# Altium project HV DAC 8ch.PrjPCB (part 1 of 6)
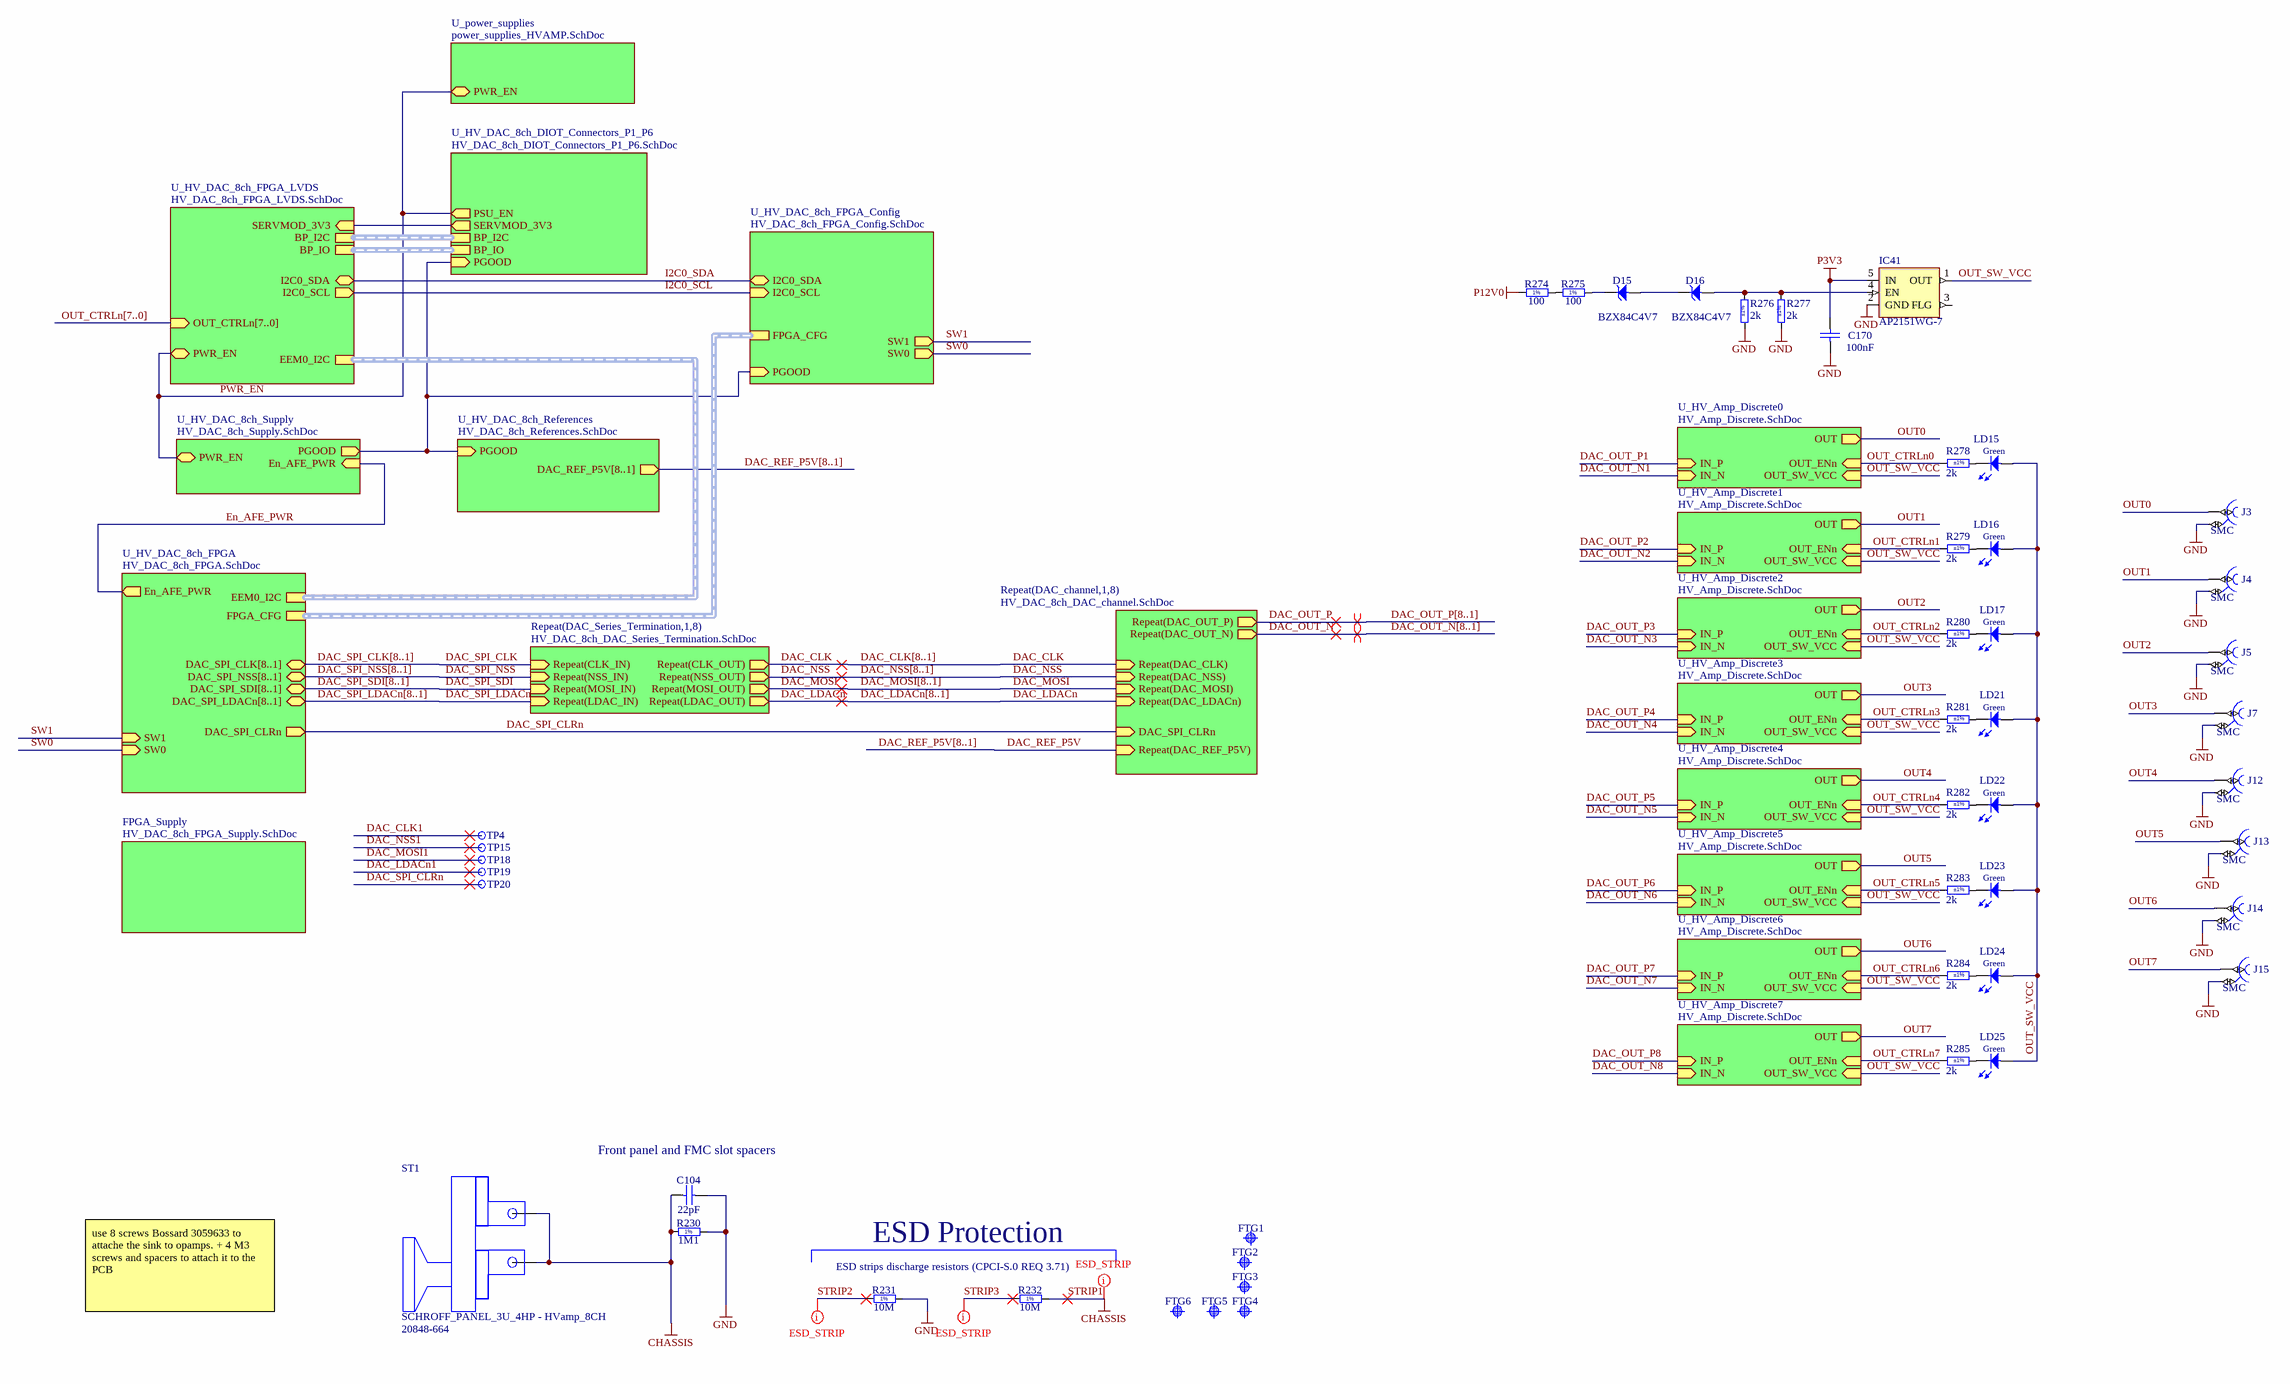
[diagram p0: HV_DAC_8ch-DIOT.schdoc]
revision: 1.0
10 sheets, 908 parts. Net scope: hierarchical (ports join the sheet entries above them; power ports are global).
Board file: HV_DAC_8ch-DIOT.PCBDOC
Sheets:
  HV_DAC_8ch-DIOT.schdoc
    DAC_channel1 = HV_DAC_8ch_DAC_channel.SchDoc
    DAC_channel2 = HV_DAC_8ch_DAC_channel.SchDoc
    DAC_channel3 = HV_DAC_8ch_DAC_channel.SchDoc
    DAC_channel4 = HV_DAC_8ch_DAC_channel.SchDoc
    DAC_channel5 = HV_DAC_8ch_DAC_channel.SchDoc
    DAC_channel6 = HV_DAC_8ch_DAC_channel.SchDoc
    DAC_channel7 = HV_DAC_8ch_DAC_channel.SchDoc
    DAC_channel8 = HV_DAC_8ch_DAC_channel.SchDoc
    U_HV_DAC_8ch_FPGA = HV_DAC_8ch_FPGA.SchDoc
    U_HV_DAC_8ch_FPGA_Config = HV_DAC_8ch_FPGA_Config.SchDoc
    U_HV_DAC_8ch_FPGA_LVDS = HV_DAC_8ch_FPGA_LVDS.SchDoc
    U_HV_DAC_8ch_References = HV_DAC_8ch_References.SchDoc
    U_HV_DAC_8ch_Supply = HV_DAC_8ch_Supply.SchDoc
    U_HV_DAC_8ch_DIOT_Connectors_P1_P6 = HV_DAC_8ch_DIOT_Connectors_P1_P6.SchDoc
    U_power_supplies = power_supplies_HVAMP.SchDoc
    U_HV_Amp_Discrete0 = HV_Amp_Discrete.SchDoc
    U_HV_Amp_Discrete1 = HV_Amp_Discrete.SchDoc
    U_HV_Amp_Discrete2 = HV_Amp_Discrete.SchDoc
    U_HV_Amp_Discrete3 = HV_Amp_Discrete.SchDoc
    U_HV_Amp_Discrete4 = HV_Amp_Discrete.SchDoc
    U_HV_Amp_Discrete5 = HV_Amp_Discrete.SchDoc
    U_HV_Amp_Discrete6 = HV_Amp_Discrete.SchDoc
    U_HV_Amp_Discrete7 = HV_Amp_Discrete.SchDoc

## Sheet HV_DAC_8ch-DIOT.schdoc: Fastino v1.3 DIOT
size A2; EDA_Number: ARTIQ; Projet: Fastino; Author: G.Kasprowicz; CompanyName: WUT ISE; DrawnBy: G.Kasprowicz; Organization: WUT ISE; Address1: PW ISE; Address2: Nowowiejska 15/19 00-665 Warsaw; Address3: gkasprow@gmail.com; DocumentNumber: 1; Revision: 2; SheetNumber: 1; SheetTotal: 12; ModifiedBy: -; CheckedDate: -; Title2: Top; DivGrp: WUT ISE; Designer: G.Kasprowicz; ModifiedDate: -; ProjectName: Sensor Box

### Parts
C104  22pF  [CAPC1005X55N]
C170  100nF  [CAPC1005X55N]
D15  BZX84C4V7  [SOT95P240X130-3N]
D16  BZX84C4V7  [SOT95P240X130-3N]
FTG1  Use only in PCB  [FIDUCIAL_TOP_C100-200]  (value not drawn)
FTG2  Use only in PCB  [FIDUCIAL_TOP_S100-200]  (value not drawn)
FTG3  Use only in PCB  [FIDUCIAL_TOP_S100-200]  (value not drawn)
FTG4  Use only in PCB  [FIDUCIAL_TOP_S100-200]  (value not drawn)
FTG5  Use only in PCB  [FIDUCIAL_TOP_S100-200]  (value not drawn)
FTG6  Use only in PCB  [FIDUCIAL_TOP_S100-200]  (value not drawn)
IC41  AP2151WG-7  [SOT23-5]
J3  SMC  [JOHNSON_131-6701-341]
J4  SMC  [JOHNSON_131-6701-341]
J5  SMC  [JOHNSON_131-6701-341]
J7  SMC  [JOHNSON_131-6701-341]
J12  SMC  [JOHNSON_131-6701-341]
J13  SMC  [JOHNSON_131-6701-341]
J14  SMC  [JOHNSON_131-6701-341]
J15  SMC  [JOHNSON_131-6701-341]
LD15  Green  [LED_AVAGO_HSME-C120]
LD16  Green  [LED_AVAGO_HSME-C120]
LD17  Green  [LED_AVAGO_HSME-C120]
LD21  Green  [LED_AVAGO_HSME-C120]
LD22  Green  [LED_AVAGO_HSME-C120]
LD23  Green  [LED_AVAGO_HSME-C120]
LD24  Green  [LED_AVAGO_HSME-C120]
LD25  Green  [LED_AVAGO_HSME-C120]
R230  1M1  [RESC2012X60N]
R231  10M  [RESC2113X55N]
R232  10M  [RESC2113X55N]
R274  100  [RESC1005X40N]
R275  100  [RESC1005X40N]
R276  2k  Tolerance: ±1%  [RESC1005X40N]
R277  2k  Tolerance: ±1%  [RESC1005X40N]
R278  2k  Tolerance: ±1%  [RESC1005X40N]
R279  2k  Tolerance: ±1%  [RESC1005X40N]
R280  2k  Tolerance: ±1%  [RESC1005X40N]
R281  2k  Tolerance: ±1%  [RESC1005X40N]
R282  2k  Tolerance: ±1%  [RESC1005X40N]
R283  2k  Tolerance: ±1%  [RESC1005X40N]
R284  2k  Tolerance: ±1%  [RESC1005X40N]
R285  2k  Tolerance: ±1%  [RESC1005X40N]
ST1  SCHROFF_PANEL_3U_4HP - HVamp_8CH  Manufacturer Part Number 2: 20848-664  [SCHROFF_PANEL_3U_4HP - HVamp_8CH]
TP4  Test Point  [TPS127]  (value not drawn)
TP15  Test Point  [TPS127]  (value not drawn)
TP18  Test Point  [TPS127]  (value not drawn)
TP19  Test Point  [TPS127]  (value not drawn)
TP20  Test Point  [TPS127]  (value not drawn)

### Sub-sheets
FPGA_Supply = HV_DAC_8ch_FPGA_Supply.SchDoc (file not in this document): no entries
Repeat(DAC_channel,1,8) = HV_DAC_8ch_DAC_channel.SchDoc: Repeat(DAC_OUT_P) (out), Repeat(DAC_OUT_N) (out), Repeat(DAC_CLK) (in), Repeat(DAC_NSS) (in), Repeat(DAC_MOSI) (in), DAC_SPI_CLRn (in), Repeat(DAC_LDACn) (in), Repeat(DAC_REF_P5V) (in)
Repeat(DAC_Series_Termination,1,8) = HV_DAC_8ch_DAC_Series_Termination.SchDoc (file not in this document): Repeat(CLK_IN) (in), Repeat(NSS_IN) (in), Repeat(MOSI_IN) (in), Repeat(LDAC_IN) (in), Repeat(CLK_OUT) (out), Repeat(NSS_OUT) (out), Repeat(LDAC_OUT) (out), Repeat(MOSI_OUT) (out)
U_HV_Amp_Discrete0 = HV_Amp_Discrete.SchDoc: OUT (out), IN_P (in), IN_N (in), OUT_ENn (in), OUT_SW_VCC (in)
U_HV_Amp_Discrete1 = HV_Amp_Discrete.SchDoc: OUT (out), IN_P (in), IN_N (in), OUT_ENn (in), OUT_SW_VCC (in)
U_HV_Amp_Discrete2 = HV_Amp_Discrete.SchDoc: OUT (out), IN_P (in), IN_N (in), OUT_ENn (in), OUT_SW_VCC (in)
U_HV_Amp_Discrete3 = HV_Amp_Discrete.SchDoc: OUT (out), IN_P (in), IN_N (in), OUT_ENn (in), OUT_SW_VCC (in)
U_HV_Amp_Discrete4 = HV_Amp_Discrete.SchDoc: OUT (out), IN_P (in), IN_N (in), OUT_ENn (in), OUT_SW_VCC (in)
U_HV_Amp_Discrete5 = HV_Amp_Discrete.SchDoc: OUT (out), IN_P (in), IN_N (in), OUT_ENn (in), OUT_SW_VCC (in)
U_HV_Amp_Discrete6 = HV_Amp_Discrete.SchDoc: OUT (out), IN_P (in), IN_N (in), OUT_ENn (in), OUT_SW_VCC (in)
U_HV_Amp_Discrete7 = HV_Amp_Discrete.SchDoc: OUT (out), IN_P (in), IN_N (in), OUT_ENn (in), OUT_SW_VCC (in)
U_HV_DAC_8ch_DIOT_Connectors_P1_P6 = HV_DAC_8ch_DIOT_Connectors_P1_P6.SchDoc: SERVMOD_3V3 (out), BP_I2C (harness I2C), BP_IO (harness EEM_LVDS), PSU_EN (out), PGOOD (in)
U_HV_DAC_8ch_FPGA = HV_DAC_8ch_FPGA.SchDoc: DAC_SPI_LDACn[8..1] (bidir), DAC_SPI_SDI[8..1] (bidir), DAC_SPI_NSS[8..1] (bidir), DAC_SPI_CLRn (out), DAC_SPI_CLK[8..1] (bidir), FPGA_CFG (harness FPGA_CFG), SW1 (in), SW0 (in), EEM0_I2C (harness I2C), En_AFE_PWR (out)
U_HV_DAC_8ch_FPGA_Config = HV_DAC_8ch_FPGA_Config.SchDoc: PGOOD (in), FPGA_CFG (harness FPGA_CFG), SW1 (out), SW0 (out), I2C0_SCL (in), I2C0_SDA (bidir)
U_HV_DAC_8ch_FPGA_LVDS = HV_DAC_8ch_FPGA_LVDS.SchDoc: EEM0_I2C (harness I2C), PWR_EN (bidir), OUT_CTRLn[7..0] (in), I2C0_SDA (bidir), I2C0_SCL (out), BP_IO (harness EEM_LVDS), BP_I2C (harness I2C), SERVMOD_3V3 (in)
U_HV_DAC_8ch_References = HV_DAC_8ch_References.SchDoc: PGOOD (in), DAC_REF_P5V[8..1] (out)
U_HV_DAC_8ch_Supply = HV_DAC_8ch_Supply.SchDoc: PGOOD (out), PWR_EN (bidir), En_AFE_PWR (in)
U_power_supplies = power_supplies_HVAMP.SchDoc: PWR_EN (bidir)

### Nets
CHASSIS: C104.1 R230.1 R232.2 ST1.0 ST1.1  [also labelled STRIP1]
GND: C104.2 C170.1 IC41.2(GND) J3.2 J4.2 J5.2 J7.2 J12.2 J13.2 J14.2 J15.2 R230.2 R231.2 R276.2 R277.2
P3V3: C170.2 IC41.5(IN)
P12V0: R274.1
DAC_CLK: sheet Repeat(DAC_channel,1,8)/Repeat(DAC_CLK), sheet Repeat(DAC_Series_Termination,1,8)/Repeat(CLK_OUT)
DAC_CLK1: TP4.1
DAC_LDACn: sheet Repeat(DAC_channel,1,8)/Repeat(DAC_LDACn), sheet Repeat(DAC_Series_Termination,1,8)/Repeat(LDAC_OUT)
DAC_LDACn1: TP19.1
DAC_MOSI: sheet Repeat(DAC_channel,1,8)/Repeat(DAC_MOSI), sheet Repeat(DAC_Series_Termination,1,8)/Repeat(MOSI_OUT)
DAC_MOSI1: TP18.1
DAC_NSS: sheet Repeat(DAC_channel,1,8)/Repeat(DAC_NSS), sheet Repeat(DAC_Series_Termination,1,8)/Repeat(NSS_OUT)
DAC_NSS1: TP15.1
DAC_OUT_N: sheet Repeat(DAC_channel,1,8)/Repeat(DAC_OUT_N)
DAC_OUT_P: sheet Repeat(DAC_channel,1,8)/Repeat(DAC_OUT_P)
DAC_REF_P5V: sheet Repeat(DAC_channel,1,8)/Repeat(DAC_REF_P5V)
DAC_SPI_CLK: sheet Repeat(DAC_Series_Termination,1,8)/Repeat(CLK_IN)
DAC_SPI_CLRn: TP20.1 ; sheet Repeat(DAC_channel,1,8)/DAC_SPI_CLRn, sheet U_HV_DAC_8ch_FPGA/DAC_SPI_CLRn
DAC_SPI_LDACn: sheet Repeat(DAC_Series_Termination,1,8)/Repeat(LDAC_IN)
DAC_SPI_NSS: sheet Repeat(DAC_Series_Termination,1,8)/Repeat(NSS_IN)
DAC_SPI_SDI: sheet Repeat(DAC_Series_Termination,1,8)/Repeat(MOSI_IN)
En_AFE_PWR: sheet U_HV_DAC_8ch_FPGA/En_AFE_PWR, sheet U_HV_DAC_8ch_Supply/En_AFE_PWR
I2C0_SCL: sheet U_HV_DAC_8ch_FPGA_Config/I2C0_SCL, sheet U_HV_DAC_8ch_FPGA_LVDS/I2C0_SCL
I2C0_SDA: sheet U_HV_DAC_8ch_FPGA_Config/I2C0_SDA, sheet U_HV_DAC_8ch_FPGA_LVDS/I2C0_SDA
OUT0: J3.1 ; sheet U_HV_Amp_Discrete0/OUT
OUT1: J4.1 ; sheet U_HV_Amp_Discrete1/OUT
OUT2: J5.1 ; sheet U_HV_Amp_Discrete2/OUT
OUT3: J7.1 ; sheet U_HV_Amp_Discrete3/OUT
OUT4: J12.1 ; sheet U_HV_Amp_Discrete4/OUT
OUT5: J13.1 ; sheet U_HV_Amp_Discrete5/OUT
OUT6: J14.1 ; sheet U_HV_Amp_Discrete6/OUT
OUT7: J15.1 ; sheet U_HV_Amp_Discrete7/OUT
OUT_CTRLn0: R278.2 ; sheet U_HV_Amp_Discrete0/OUT_ENn
OUT_CTRLn1: R279.2 ; sheet U_HV_Amp_Discrete1/OUT_ENn
OUT_CTRLn2: R280.2 ; sheet U_HV_Amp_Discrete2/OUT_ENn
OUT_CTRLn3: R281.2 ; sheet U_HV_Amp_Discrete3/OUT_ENn
OUT_CTRLn4: R282.2 ; sheet U_HV_Amp_Discrete4/OUT_ENn
OUT_CTRLn5: R283.2 ; sheet U_HV_Amp_Discrete5/OUT_ENn
OUT_CTRLn6: R284.2 ; sheet U_HV_Amp_Discrete6/OUT_ENn
OUT_CTRLn7: R285.2 ; sheet U_HV_Amp_Discrete7/OUT_ENn
OUT_SW_VCC: IC41.1(OUT) LD15.2(A) LD16.2(A) LD17.2(A) LD21.2(A) LD22.2(A) LD23.2(A) LD24.2(A) LD25.2(A) ; sheet U_HV_Amp_Discrete0/OUT_SW_VCC, sheet U_HV_Amp_Discrete1/OUT_SW_VCC, sheet U_HV_Amp_Discrete2/OUT_SW_VCC, sheet U_HV_Amp_Discrete3/OUT_SW_VCC, sheet U_HV_Amp_Discrete4/OUT_SW_VCC, sheet U_HV_Amp_Discrete5/OUT_SW_VCC, sheet U_HV_Amp_Discrete6/OUT_SW_VCC, sheet U_HV_Amp_Discrete7/OUT_SW_VCC
PGOOD: sheet U_HV_DAC_8ch_FPGA_Config/PGOOD, sheet U_HV_DAC_8ch_References/PGOOD, sheet U_HV_DAC_8ch_Supply/PGOOD, sheet U_HV_DAC_8ch_DIOT_Connectors_P1_P6/PGOOD
PWR_EN: sheet U_HV_DAC_8ch_FPGA_LVDS/PWR_EN, sheet U_HV_DAC_8ch_Supply/PWR_EN, sheet U_HV_DAC_8ch_DIOT_Connectors_P1_P6/PSU_EN, sheet U_power_supplies/PWR_EN
SERVMOD_3V3: sheet U_HV_DAC_8ch_FPGA_LVDS/SERVMOD_3V3, sheet U_HV_DAC_8ch_DIOT_Connectors_P1_P6/SERVMOD_3V3
STRIP2: R231.1
STRIP3: R232.1
SW0: sheet U_HV_DAC_8ch_FPGA/SW0, sheet U_HV_DAC_8ch_FPGA_Config/SW0
SW1: sheet U_HV_DAC_8ch_FPGA/SW1, sheet U_HV_DAC_8ch_FPGA_Config/SW1
NetD15_1: D15.1(A) D16.3(C)
NetD15_3: D15.3(C) R275.2
NetD16_1: D16.1(A) IC41.4(EN) R276.1 R277.1
NetLD15_1: LD15.1(C) R278.1
NetLD16_1: LD16.1(C) R279.1
NetLD17_1: LD17.1(C) R280.1
NetLD21_1: LD21.1(C) R281.1
NetLD22_1: LD22.1(C) R282.1
NetLD23_1: LD23.1(C) R283.1
NetLD24_1: LD24.1(C) R284.1
NetLD25_1: LD25.1(C) R285.1
NetR274_2: R274.2 R275.1

Not connected (* = marked no-connect by the designer): IC41 3(FLG)

### Buses and harness runs
bus DAC_CLK[8..1]
bus DAC_LDACn[8..1]
bus DAC_MOSI[8..1]
bus DAC_NSS[8..1]
bus DAC_OUT_N[8..1]
bus DAC_OUT_P[8..1]
bus DAC_REF_P5V[8..1]
bus DAC_REF_P5V[8..1] = sheet U_HV_DAC_8ch_References/DAC_REF_P5V[8..1]
bus DAC_SPI_CLK[8..1] = sheet U_HV_DAC_8ch_FPGA/DAC_SPI_CLK[8..1]
bus DAC_SPI_LDACn[8..1] = sheet U_HV_DAC_8ch_FPGA/DAC_SPI_LDACn[8..1]
bus DAC_SPI_NSS[8..1] = sheet U_HV_DAC_8ch_FPGA/DAC_SPI_NSS[8..1]
bus DAC_SPI_SDI[8..1] = sheet U_HV_DAC_8ch_FPGA/DAC_SPI_SDI[8..1]
bus OUT_CTRLn[7..0] = sheet U_HV_DAC_8ch_FPGA_LVDS/OUT_CTRLn[7..0]
harness sheet U_HV_DAC_8ch_DIOT_Connectors_P1_P6/BP_I2C = sheet U_HV_DAC_8ch_FPGA_LVDS/BP_I2C
harness sheet U_HV_DAC_8ch_DIOT_Connectors_P1_P6/BP_IO = sheet U_HV_DAC_8ch_FPGA_LVDS/BP_IO
harness sheet U_HV_DAC_8ch_FPGA/EEM0_I2C = sheet U_HV_DAC_8ch_FPGA_LVDS/EEM0_I2C
harness sheet U_HV_DAC_8ch_FPGA/FPGA_CFG = sheet U_HV_DAC_8ch_FPGA_Config/FPGA_CFG

### Layout directives
differential pair: DAC_OUT_N, DAC_OUT_P
net class ESD_STRIP: CHASSIS, STRIP2, STRIP3

### Notes on the sheet
- (near C104) Front panel and FMC slot spacers
- ESD strips discharge resistors (CPCI-S.0 REQ 3.71)
- ESD Protection
- use 8 screws Bossard 3059633 to attache the sink to opamps. + 4 M3 screws and spacers to attach it to the PCB
- Project/Equipment
- Document
- Designer
- Drawn by
- Check.by
- Last Mod.
- Contact
- File
- Print Date
- Sheet
- Size
- A2
- of
- Rev
- (in symbol R0402_100R_1%_0.0625W_100PPM) 1%
- (in symbol R0805_1M1_1%_0.125W_100PPM) 1%
- (in symbol R0805_10M_1%_0.125W_100PPM_VISHAY_CRCW e3) 1%

### Library data of the parts
C104 = CC0402_22PF_50V_5%_C0G: Non-polarised capacitor; Part Description: SMD Multilayer Chip Ceramic Capacitor; Manufacturer: GENERIC; Manufacturer1 Part Number: C0402C220J5GACTU; Voltage: 50V; TC: C0G/NP0; Tolerance: ±5%; Part Number: CC0402_22PF_50V_5%_C0G; Component Kind: Standard; Component Type: Standard; Pin Count: 2; Value: 22pF; Status: Preferred; Manufacturer Part Number: CC0402_22PF_50V_5%_C0G; Case: 0402; Mounted: Yes; Socket: No; SMD: Yes; Manufacturer1 Example: KEMET; Manufacturer1 ComponentHeight: 0.55mm; HelpURL: \\cern.ch\dfs\Applications\Altium\Datasheets\CC0402_C0G_KEMET_(Commercial Grade).pdf; Author: CERN DEM JLC; CreateDate: 2007-12-03; LatestRevisionDate: 2007-12-03; Sense: No
C170 = CC0402_100NF_16V_10%_X5R: Non-polarised capacitor; Part Description: SMD Multilayer Chip Ceramic Capacitor; Manufacturer: GENERIC; Manufacturer1 Part Number: GRM155R61C104KA88D; Voltage: 16V; TC: X5R; Tolerance: ±10%; Part Number: CC0402_100NF_16V_10%_X5R; Component Kind: Standard; Component Type: Standard; Pin Count: 2; Value: 100nF; Status: None; Manufacturer Part Number: CC0402_100NF_16V_10%_X5R; Case: 0402; Mounted: Yes; Socket: No; SMD: Yes; Sense: No; Manufacturer1 Example: MURATA; Manufacturer1 ComponentHeight: 0.55mm; HelpURL: \\cern.ch\dfs\Applications\Altium\Datasheets\CC0402_X5R_MURATA_GRM.pdf; Author: CERN DEM JLC; CreateDate: 10.12.2013; LatestRevisionDate: 10.12.2013
D15 D16 = BZX84C4V7: Diode Zener Anode Pin 1 Cathode Pin 3 (Pas de pin 2); Part Description: Zener Diode; Manufacturer: FAIRCHILD SEMICONDUCTOR; Voltage: 4V7; Power: 350mW; PressFit: No; Bonding: No; Part Number: BZX84C4V7; Component Kind: Standard; Component Type: Standard; Device: BZX84C4V7; PackageDescription: SOT, 0.95mm Pitch; 3 Pin, 1.30mm W X 2.90mm L X 1.30mm H body, IPC Medium Density; Manufacturer Part Number: BZX84C4V7; Pin Count: 3; Case: SOT23-3; Mounted: Yes; Socket: No; SMD: Yes; Sense: No; ComponentHeight: 1.3mm; HelpURL: \\cern.ch\dfs\Applications\Altium\Datasheets\BZX84C4V7.pdf; Author: CERN DEM JLC; CreateDate: 15.06.2011; LatestRevisionDate: 15.06.2011
FTG1 = FIDUCIAL_TARGET_C100-200: Fiducial Target; Part Description: Round Fiducial Target, Top Layer, 1.0mm, Top Solder 2.0mm, Keepout =2.0mm; Mounted: No; Part Number: FIDUCIAL_TARGET_C100-200; Component Kind: Standard (No BOM); Component Type: Standard (No BOM); Pin Count: 1; Family: Fiducial; Socket: No; SMD: Yes; Sense: No; Status: None; ComponentHeight: 0mm; HelpURL: Undefined; Author: CERN DEM JLC; CreateDate: 09.02.2010; LatestRevisionDate: 04.04.2012; PackageDescription: Round Fiducial Target, Top Layer, 1.0mm, Top Solder 2.0mm, Keepout =2.0mm
FTG2-FTG6 = FIDUCIAL_TARGET_S100-200: Fiducial Target; Part Description: Square Fiducial Target, Top Layer, 1.0mm, Top Solder 2.0mm, Keepout =2.0mm; Mounted: No; Part Number: FIDUCIAL_TARGET_S100-200; Component Kind: Standard (No BOM); Component Type: Standard (No BOM); Pin Count: 1; Family: Fiducial; Socket: No; SMD: Yes; Sense: No; Status: None; ComponentHeight: 0mm; HelpURL: Undefined; Author: CERN DEM JLC; CreateDate: 09.02.2010; LatestRevisionDate: 04.04.2012; PackageDescription: Square Fiducial Target, Top Layer, 1.0mm, Top Solder 2.0mm, Keepout =2.0mm
IC41 = IFC_AP2151: 0.5A SINGLE CHANNEL CURRENT- LIMITED POWER Switch
J3-J5 J7 J12-J15 = JOHNSON_131-6701-341: Part Description: SMC 50 Ohms Right Angle Bulkhead Jack Receptacle; PressFit: No; Part Number: JOHNSON_131-6701-341; Component Kind: Standard; Component Type: Standard; Pin Count: 2; Family: SMC; Mounted: Yes; Socket: No; SMD: No; Sense: No; Status: None; Manufacturer: JOHNSON; Manufacturer Part Number: 131-6701-341; ComponentHeight: 7.67mm; HelpURL: \\cern.ch\dfs\Applications\Altium\Datasheets\JOHNSON_131-6701-341.pdf; Author: CERN DEM JLC; CreateDate: 16.02.2010; LatestRevisionDate: 12.01.2017
LD15-LD17 LD21-LD25 = LED_AVAGO_HSME-C120: LED Green 1C 2A; Part Description: High Performance Right Angle Chip Green LED; Manufacturer: AVAGO TECHNOLOGIES; PressFit: No; Bonding: No; Part Number: LED_AVAGO_HSME-C120; Component Kind: Standard; Component Type: Standard; Color: Green; PackageDescription: Green Chip LED, 2-Leads, Body 1.7x1.1mm, Side Emitting Package; Manufacturer Part Number: HSME-C120; Pin Count: 2; Mounted: Yes; Socket: No; SMD: Yes; Sense: No; ComponentHeight: 0.7mm; HelpURL: \\cern.ch\dfs\Applications\Altium\Datasheets\LED_AVAGO_HSME-C120.pdf; ComponentLink1URL: \\cern.ch\dfs\Applications\Altium\Datasheets\LED_AVAGO_HSME-C110_DESIGN-GUIDE.pdf; ComponentLink1Description: Design Guide; Author: CERN DEM JMW; CreateDate: 22.07.2009; LatestRevisionDate: 20.06.2012
R230 = R0805_1M1_1%_0.125W_100PPM: Resistor - 1%; Part Description: General Purpose Thick Film Chip Resistor; Manufacturer: GENERIC; Manufacturer1 Part Number: NRC10F1104TRF; Power: 0.125W; TC: ±100ppm/°C; PressFit: No; Part Number: R0805_1M1_1%_0.125W_100PPM; Component Kind: Standard; Component Type: Standard; Pin Count: 2; Value: 1M1; Status: Preferred; Tolerance: ±1%; Manufacturer Part Number: R0805_1M1_1%_0.125W_100PPM; Case: 0805; Mounted: Yes; Sense: No; Socket: No; SMD: Yes; Manufacturer1 Example: NIC COMPONENT; Manufacturer1 ComponentHeight: 0.6mm; HelpURL: \\cern.ch\dfs\Applications\Altium\Datasheets\R0805_NIC_NRC.pdf; Author: CERN DEM JLC; CreateDate: 03/12/2007; LatestRevisionDate: 13/03/2008
R231 R232 = R0805_10M_1%_0.125W_100PPM_VISHAY_CRCW e3: Resistor - 1%; Part Description: 150V, Standard Thick Film Chip Resistor; Manufacturer: VISHAY DALE; Manufacturer Part Number: CRCW080510M0FKEA; Power: 0.125W; TC: ±100ppm/°C; PressFit: No; Part Number: R0805_10M_1%_0.125W_100PPM_VISHAY_CRCW e3; Component Kind: Standard; Component Type: Standard; Pin Count: 2; Value: 10M; Status: None; Tolerance: ±1%; Case: 0805; Mounted: Yes; Sense: No; Socket: No; SMD: Yes; ComponentHeight: 0.5mm; HelpURL: \\cern.ch\dfs\Applications\Altium\Datasheets\R0805_VISHAY_CRCW e3.pdf; Author: CERN DEM BC; CreateDate: 2019-11-12; LatestRevisionDate: 2019-11-12
R274 R275 = R0402_100R_1%_0.0625W_100PPM: Resistor - 1%; Part Description: General Purpose Thick Film Chip Resistor; Manufacturer: GENERIC; Manufacturer1 Part Number: 232270671001L; TC: ±100ppm/°C; PressFit: No; Part Number: R0402_100R_1%_0.0625W_100PPM; Component Kind: Standard; Component Type: Standard; Pin Count: 2; Value: 100; Status: Not Recommended; Power: 0.0625W; Tolerance: ±1%; Manufacturer Part Number: R0402_100R_1%_0.0625W_100PPM; Case: 0402; Mounted: Yes; Sense: No; Socket: No; SMD: Yes; Manufacturer1 Example: YAGEO PHYCOMP; Manufacturer1 ComponentHeight: 0.4mm; HelpURL: \\cern.ch\dfs\Applications\Altium\Datasheets\R0402_Phycomp_RC0402.pdf; Author: CERN DEM JLC; CreateDate: 03.12.2007; LatestRevisionDate: 17.10.2012
R276-R285 = R0402_2K_1%_0.0625W_100PPM: Resistor - 1%; Part Description: General Purpose Thick Film Chip Resistor; Manufacturer: GENERIC; Manufacturer1 Part Number: 232270672002L; TC: ±100ppm/°C; PressFit: No; Part Number: R0402_2K_1%_0.0625W_100PPM; Component Kind: Standard; Component Type: Standard; Pin Count: 2; Value: 2k; Status: Not Recommended; Power: 0.0625W; Manufacturer Part Number: R0402_2K_1%_0.0625W_100PPM; Case: 0402; Mounted: Yes; Sense: No; Socket: No; SMD: Yes; Manufacturer1 Example: YAGEO PHYCOMP; Manufacturer1 ComponentHeight: 0.4mm; HelpURL: \\cern.ch\dfs\Applications\Altium\Datasheets\R0402_Phycomp_RC0402.pdf; Author: CERN DEM JLC; CreateDate: 03.12.2007; LatestRevisionDate: 17.10.2012
ST1 = SCHROFF_PANEL_3U_4HP - HVamp_8CH: Schroff 3HP 4U EUROCARD Panel; Manufacturer Part Number: 20818-017; Manufacturer: Schroff
TP4 TP15 TP18-TP20 = SMD_PAD_1.27X1.27MM: Part Description: 1.27mm x 1.27mm PCB Copper Area (SMD Test Point); Mounted: No; Part Number: SMD_PAD_1.27X1.27MM; Component Kind: Standard (No BOM); Component Type: Standard (No BOM); Pin Count: 1; Family: Test Point; Socket: No; SMD: No; Sense: No; Status: None; ComponentHeight: 0mm; HelpURL: Undefined; Author: CERN DEM JLC; CreateDate: 12.01.2008; LatestRevisionDate: 12.01.2008; PackageDescription: 1.27mm x 1.27mm PCB Copper Area (SMD Test Point)

## Sheet HV_DAC_8ch_DAC_channel.SchDoc: Fastino
size 420 x 297 mm; EDA_Number: ARTIQ; Projet: Fastino; Author: G.Kasprowicz; CompanyName: WUT ISE; DrawnBy: G.Kasprowicz; Organization: WUT ISE; Address1: PW ISE; Address2: Nowowiejska 15/19 00-665 Warsaw; Address3: gkasprow@gmail.com; DocumentNumber: 2; Revision: 2; SheetNumber: 2; SheetTotal: 12; ModifiedBy: -; CheckedDate: -; Title2: DAC channel; DivGrp: WUT ISE; Designer: G.Kasprowicz; ModifiedDate: -; ProjectName: Sensor Box
Used 8 times, as channels DAC_channel1, DAC_channel2, DAC_channel3, DAC_channel4, DAC_channel5, DAC_channel6, DAC_channel7, DAC_channel8. Parts and nets are listed once, with the designators drawn on the sheet.
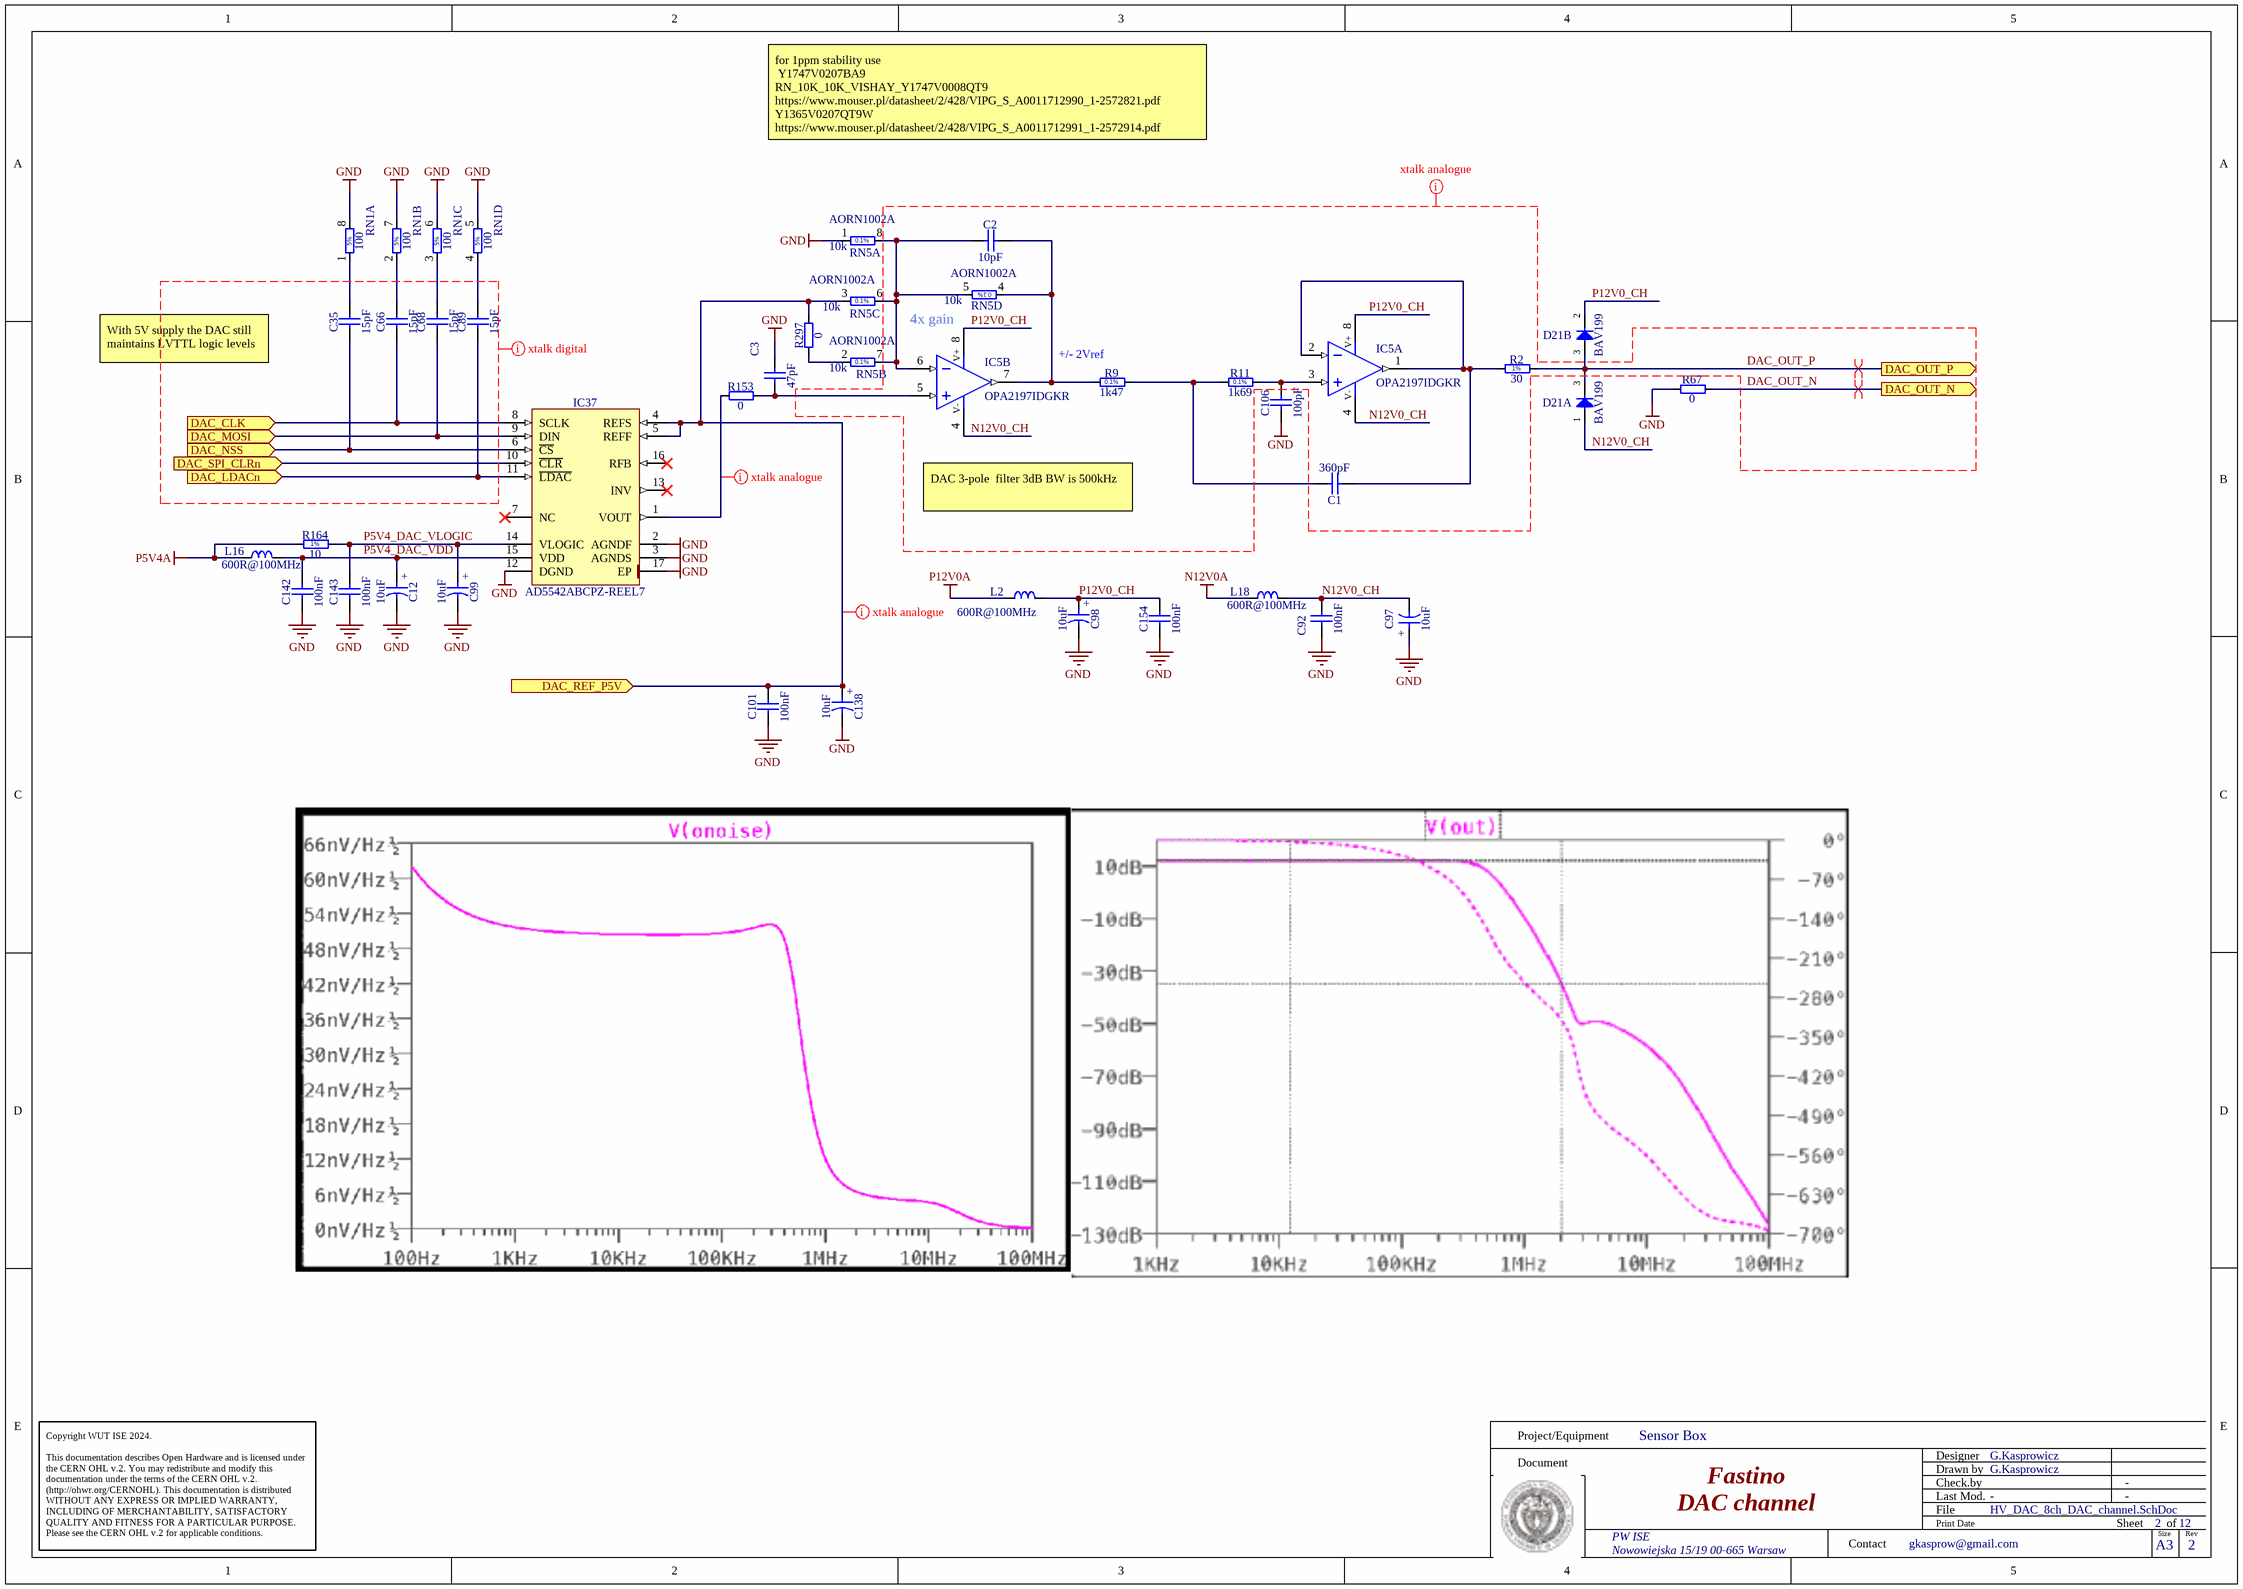
[diagram p1: HV_DAC_8ch_DAC_channel.SchDoc]

### Parts
C1  360pF  [CAPC1608X90N]
C2  10pF  [CAPC1005X55N]
C3  47pF  [CAPC1005X55N]
C12  10uF  [CAPMP3216X180N]
C35  15pF  [CAPC1608X87N]
C66  15pF  [CAPC1608X87N]
C68  15pF  [CAPC1608X87N]
C89  15pF  [CAPC1608X87N]
C92  100nF  [CAPC1005X55N]
C97  10uF  [CAPMP3216X180N]
C98  10uF  [CAPMP3216X180N]
C99  10uF  [CAPMP3216X180N]
C101  100nF  [CAPC1005X55N]
C106  100pF  [CAPC1608X90N]
C138  10uF  [CAPMP3216X180N]
C142  100nF  [CAPC1005X55N]
C143  100nF  [CAPC1005X55N]
C154  100nF  [CAPC1005X55N]
D21  BAV199  [SOT95P240X110-3N]  (parts A,B of 2)
IC5  OPA2197IDGKR  [SOP65P490X110-8N]  (parts A,B of 2)
IC37  AD5542ABCPZ-REEL7  [QFN50P300X300X80-17N-S175]
L2  600R@100MHz  [INDC1005X55N]
L16  600R@100MHz  [INDC1005X55N]
L18  600R@100MHz  [INDC1005X55N]
R2  30  [RESC1608X55N]
R9  1k47  [RESC1608X55N]
R11  1k69  [RESC1608X55N]
R67  0  [RESC1608X55N]
R153  0  [RESC1005X40N]
R164  10  [RESC1005X40N]
R297  0  [RESC0603X28N]
RN1  100  [RN_YAGEO_TC124]  (parts A,B,C,D of 4)
RN5  Manufacturer Part Number: AORN1002A  [SOIC127P600X175-8N]  (hidden comment: 10k)  (parts A,B,C,D of 4)

### Ports
DAC_CLK (in), DAC_LDACn (in), DAC_MOSI (in), DAC_NSS (in), DAC_OUT_N (out), DAC_OUT_P (out), DAC_REF_P5V (in), DAC_SPI_CLRn (in)

### Nets
GND: C3.2 C12.2 C92.1 C97.1 C98.2 C99.2 C101.1 C106.1 C138.2 C142.1 C143.1 C154.1 IC37.2(AGNDF) IC37.3(AGNDS) IC37.12(DGND) IC37.17(EP) R67.1 RN1.5 RN1.6 RN1.7 RN1.8 RN5.1
N12V0A: L18.1
P5V4A: L16.1 R164.1
P12V0A: L2.1
DAC_CLK: C66.1 IC37.8(SCLK) ; port DAC_CLK
DAC_LDACn: C89.1 IC37.11(~{LDAC}) ; port DAC_LDACn
DAC_MOSI: C68.1 IC37.9(DIN) ; port DAC_MOSI
DAC_NSS: C35.1 IC37.6(~{CS}) ; port DAC_NSS
DAC_OUT_N: R67.2 ; port DAC_OUT_N
DAC_OUT_P: D21.3(COMAC) R2.2 ; port DAC_OUT_P
DAC_REF_P5V: C101.2 C138.1 IC37.4(REFS) IC37.5(REFF) R297.2 RN5.3 ; port DAC_REF_P5V
DAC_SPI_CLRn: IC37.10(~{CLR}) ; port DAC_SPI_CLRn
N12V0_CH: C92.2 C97.2 D21.1(A) IC5.4(V-) L18.2
P5V4_DAC_VDD: C12.1 C142.2 IC37.15(VDD) L16.2
P5V4_DAC_VLOGIC: C99.1 C143.2 IC37.14(VLOGIC) R164.2
P12V0_CH: C98.1 C154.2 D21.2(C) IC5.8(V+) L2.2
NetC1_1: C1.1 IC5.1(OUT) IC5.2(IN-) R2.1
NetC1_2: C1.2 R9.2 R11.1
NetC2_1: C2.1 IC5.6(IN-) RN5.5 RN5.6 RN5.7 RN5.8
NetC2_2: C2.2 IC5.7(OUT) R9.1 RN5.4
NetC3_1: C3.1 IC5.5(IN+) R153.2
NetC35_2: C35.2 RN1.1
NetC66_2: C66.2 RN1.2
NetC68_2: C68.2 RN1.3
NetC89_2: C89.2 RN1.4
NetC106_2: C106.2 IC5.3(IN+) R11.2
NetIC37_1: IC37.1(VOUT) R153.1
NetR297_1: R297.1 RN5.2

Not connected (* = marked no-connect by the designer): IC37 7(NC)* 13(INV)* 16(RFB)*

### Channels
DAC_channel1: designators end in _1; ports DAC_CLK=DAC_CLK1 DAC_LDACn=DAC_LDACn1 DAC_MOSI=DAC_MOSI1 DAC_NSS=DAC_NSS1 DAC_OUT_N=DAC_OUT_N DAC_OUT_P=DAC_OUT_P DAC_REF_P5V=DAC_REF_P5V1 DAC_SPI_CLRn=DAC_SPI_CLRn
DAC_channel2: designators end in _2; ports DAC_CLK=DAC_CLK2 DAC_LDACn=DAC_LDACn2 DAC_MOSI=DAC_MOSI2 DAC_NSS=DAC_NSS2 DAC_OUT_N=DAC_OUT_N DAC_OUT_P=DAC_OUT_P DAC_REF_P5V=DAC_REF_P5V2 DAC_SPI_CLRn=DAC_SPI_CLRn
DAC_channel3: designators end in _3; ports DAC_CLK=DAC_CLK3 DAC_LDACn=DAC_LDACn3 DAC_MOSI=DAC_MOSI3 DAC_NSS=DAC_NSS3 DAC_OUT_N=DAC_OUT_N DAC_OUT_P=DAC_OUT_P DAC_REF_P5V=DAC_REF_P5V3 DAC_SPI_CLRn=DAC_SPI_CLRn
DAC_channel4: designators end in _4; ports DAC_CLK=DAC_CLK4 DAC_LDACn=DAC_LDACn4 DAC_MOSI=DAC_MOSI4 DAC_NSS=DAC_NSS4 DAC_OUT_N=DAC_OUT_N DAC_OUT_P=DAC_OUT_P DAC_REF_P5V=DAC_REF_P5V4 DAC_SPI_CLRn=DAC_SPI_CLRn
DAC_channel5: designators end in _5; ports DAC_CLK=DAC_CLK5 DAC_LDACn=DAC_LDACn5 DAC_MOSI=DAC_MOSI5 DAC_NSS=DAC_NSS5 DAC_OUT_N=DAC_OUT_N DAC_OUT_P=DAC_OUT_P DAC_REF_P5V=DAC_REF_P5V5 DAC_SPI_CLRn=DAC_SPI_CLRn
DAC_channel6: designators end in _6; ports DAC_CLK=DAC_CLK6 DAC_LDACn=DAC_LDACn6 DAC_MOSI=DAC_MOSI6 DAC_NSS=DAC_NSS6 DAC_OUT_N=DAC_OUT_N DAC_OUT_P=DAC_OUT_P DAC_REF_P5V=DAC_REF_P5V6 DAC_SPI_CLRn=DAC_SPI_CLRn
DAC_channel7: designators end in _7; ports DAC_CLK=DAC_CLK7 DAC_LDACn=DAC_LDACn7 DAC_MOSI=DAC_MOSI7 DAC_NSS=DAC_NSS7 DAC_OUT_N=DAC_OUT_N DAC_OUT_P=DAC_OUT_P DAC_REF_P5V=DAC_REF_P5V7 DAC_SPI_CLRn=DAC_SPI_CLRn
DAC_channel8: designators end in _8; ports DAC_CLK=DAC_CLK8 DAC_LDACn=DAC_LDACn8 DAC_MOSI=DAC_MOSI8 DAC_NSS=DAC_NSS8 DAC_OUT_N=DAC_OUT_N DAC_OUT_P=DAC_OUT_P DAC_REF_P5V=DAC_REF_P5V8 DAC_SPI_CLRn=DAC_SPI_CLRn

### Layout directives
differential pair; net class D100: DAC_OUT_N, DAC_OUT_P
net class xtalk analogue: DAC_OUT_N, DAC_OUT_P, DAC_REF_P5V1, N12V0_CH, NetIC37_1_1, P12V0_CH
net class xtalk digital: (no net found under the mark)

### Notes on the sheet
- for 1ppm stability use
  Y1747V0207BA9
  RN_10K_10K_VISHAY_Y1747V0008QT9
  https://www.mouser.pl/datasheet/2/428/VIPG_S_A0011712990_1-2572821.pdf
  Y1365V0207QT9W
  https://www.mouser.pl/datasheet/2/428/VIPG_S_A0011712991_1-2572914.pdf
- 4x gain
- With 5V supply the DAC still maintains LVTTL logic levels
- (near R9) +/- 2Vref
- DAC 3-pole  filter 3dB BW is 500kHz
- Project/Equipment
- Document
- Designer
- Drawn by
- Check.by
- Copyright WUT ISE 2024.
  This documentation describes Open Hardware and is licensed under the CERN OHL v.2. You may redistribute and modify this documentation under the terms of the CERN OHL v.2. (http://ohwr.org/CERNOHL). This documentation is distributed WITHOUT ANY EXPRESS OR IMPLIED WARRANTY, INCLUDING OF MERCHANTABILITY, SATISFACTORY QUALITY AND FITNESS FOR A PARTICULAR PURPOSE. Please see the CERN OHL v.2 for applicable conditions.
- Contact
- File
- Last Mod.
- Print Date
- Sheet
- Size
- A3
- of
- Rev
- (in symbol CTE3216-18_10UF_16V_20%_AVX_TCJ) +
- (in symbol R0402_10R_1%_0.0625W_200PPM) 1%
- (in symbol R0603_1K47_0.1%_0.063W_10PPM) 0.1%
- (in symbol R0603_1K69_0.1%_0.063W_10PPM) 0.1%
- (in symbol R0603_30R_1%_0.1W_100PPM) 1%
- (in symbol RES_RN_100R_YAGEO_TC124-JR-07100RL, part A) 5%
- (in symbol RES_RN_100R_YAGEO_TC124-JR-07100RL, part B) 5%
- (in symbol RES_RN_100R_YAGEO_TC124-JR-07100RL, part C) 5%
- (in symbol RES_RN_100R_YAGEO_TC124-JR-07100RL, part D) 5%
- (in symbol RN_10K_VISHAY_AORN1002A, part A) 0.1%
- (in symbol RN_10K_VISHAY_AORN1002A, part B) 0.1%
- (in symbol RN_10K_VISHAY_AORN1002A, part C) 0.1%
- (in symbol RN_10K_VISHAY_AORN1002A, part D) 0.1%

### Library data of the parts
C1 = CC0603_360PF_25V_1%_C0G: SMD Multilayer Chip Ceramic Capacitor; Manufacturer: GENERIC; Manufacturer1 Part Number: C0603C361F5GACTU; Voltage: 25; TC: C0G/NP0; Tolerance: ±1%; Part Number: CC0603_360PF_25V_1%_C0G; Component Kind: Standard; Component Type: Standard; Pin Count: 2; Value: 360pF; Status: None; Part Description: SMD Multilayer Chip Ceramic Capacitor; Manufacturer Part Number: CC0603_360PF_25V_1%_C0G; Case: 0603; Mounted: Yes; Socket: No; SMD: Yes; Sense: No; Manufacturer1 Example: KEMET; Manufacturer1 ComponentHeight: 0.9mm; HelpURL: \\cern.ch\dfs\Applications\Altium\Datasheets\CC0603_C0G_AVX.pdf; Author: GK; CreateDate: 15.06.2017; LatestRevisionDate: 15.06.2017
C2 = CC0402_10PF_50V_5%_C0G: Non-polarised capacitor; Part Description: SMD Multilayer Chip Ceramic Capacitor; Manufacturer: GENERIC; Manufacturer1 Part Number: C0402C100J5GACTU; Voltage: 50V; TC: C0G/NP0; Tolerance: ±5%; Part Number: CC0402_10PF_50V_5%_C0G; Component Kind: Standard; Component Type: Standard; Pin Count: 2; Value: 10pF; Status: Preferred; Manufacturer Part Number: CC0402_10PF_50V_5%_C0G; Case: 0402; Mounted: Yes; Socket: No; SMD: Yes; Sense: No; Manufacturer1 Example: KEMET; Manufacturer1 ComponentHeight: 0.55mm; HelpURL: \\cern.ch\dfs\Applications\Altium\Datasheets\CC0805_C0G_KEMET_(Commercial Grade).pdf; Author: CERN DEM JLC; CreateDate: 03.12.2007; LatestRevisionDate: 22.04.2015
C3 = CC0402_47PF_50V_1%_C0G_MURATA_GJM1555C1H470FB01D: Non-polarised capacitor; Part Description: High-Q SMD Chip Monolithic Ceramic Capacitor; Manufacturer: MURATA; Voltage: 50V; TC: C0G/NP0; Tolerance: ±1%; Part Number: CC0402_47PF_50V_1%_C0G_MURATA_GJM1555C1H470FB01D; Component Kind: Standard; Component Type: Standard; Pin Count: 2; Value: 47pF; Status: None; Manufacturer Part Number: GJM1555C1H470FB01D; Case: 0402; Mounted: Yes; Socket: No; SMD: Yes; Sense: No; ComponentHeight: 0.55mm; HelpURL: \\cern.ch\dfs\Applications\Altium\Datasheets\CC0402_MURATA_GJM1555C1H470FB01D.pdf; Author: CERN DEM BC; CreateDate: 20.11.2017; LatestRevisionDate: 20.11.2017
C12 C97-C99 C138 = CTE3216-18_10UF_16V_20%_AVX_TCJ: Polarised capacitor; Part Description: ESR 0R200 Tantalum Solid Electrolytic Chip Capacitor with Conductive Polymer Electrode; Manufacturer: AVX; Manufacturer Part Number: TCJA106M016R0200 or  or TR3A106K016C1700; Voltage: 16V; Tolerance: ±20%; Part Number: CTE3216-18_10UF_16V_20%_AVX_TCJ; Component Kind: Standard; Component Type: Standard; Pin Count: 2; Value: 10uF; Status: Preferred; Case: A; Mounted: Yes; Socket: No; SMD: Yes; Sense: No; ComponentHeight: 1.8mm; HelpURL: \\cern.ch\dfs\Applications\Altium\Datasheets\CTE_AVX_TCJ.pdf; Author: CERN DEM JLC; CreateDate: 29.03.2012; LatestRevisionDate: 29.03.2012
C35 C66 C68 C89 = CC0603_15PF_50V_5%_NP0: Non-polarised capacitor; Part Description: SMD Multilayer Chip Ceramic Capacitor; Manufacturer: GENERIC; Manufacturer1 Part Number: 223886715159; Voltage: 50V; TC: C0G/NP0; Tolerance: ±5%; Part Number: CC0603_15PF_50V_5%_NP0; Component Kind: Standard; Component Type: Standard; Pin Count: 2; Value: 15pF; Status: Preferred; Manufacturer Part Number: CC0603_15PF_50V_5%_NP0; Case: 0603; Mounted: Yes; Socket: No; SMD: Yes; Sense: No; Manufacturer1 Example: PHYCOMP; Manufacturer1 ComponentHeight: 0.87mm; HelpURL: \\cern.ch\dfs\Applications\Altium\Datasheets\CC0603_NP0_PHYCOMP.pdf; Author: CERN DEM JLC; CreateDate: 03/12/2007; LatestRevisionDate: 03/12/2007
C92 C101 C142 C143 C154 = CC0402_100NF_16V_10%_X7R: Non-polarised capacitor; Part Description: SMD Multilayer Chip Ceramic Capacitor; Manufacturer: GENERIC; Manufacturer1 Part Number: GRM155R71C104KA88D; Voltage: 16V; TC: X7R; Tolerance: ±10%; Part Number: CC0402_100NF_16V_10%_X7R; Component Kind: Standard; Component Type: Standard; Pin Count: 2; Value: 100nF; Status: Not Recommended; Manufacturer Part Number: CC0402_100NF_16V_10%_X7R; Case: 0402; Mounted: Yes; Socket: No; SMD: Yes; Sense: No; Manufacturer1 Example: MURATA; Manufacturer1 ComponentHeight: 0.55mm; HelpURL: \\cern.ch\dfs\Applications\Altium\Datasheets\CC0402_X7R_MURATA_GRM.pdf; Author: CERN DEM JLC; CreateDate: 2013-12-05; LatestRevisionDate: 2007-12-03
C106 = CC0603_100PF_50V_1%_NP0: Non-polarised capacitor; Part Description: SMD Multilayer Chip Ceramic Capacitor; Manufacturer: GENERIC; Manufacturer1 Part Number: 06035A101FAT2A; Voltage: 50V; TC: C0G/NP0; Tolerance: ±1%; Part Number: CC0603_100PF_50V_1%_NP0; Component Kind: Standard; Component Type: Standard; Pin Count: 2; Value: 100pF; Status: None; Manufacturer Part Number: CC0603_100PF_50V_1%_NP0; Case: 0603; Mounted: Yes; Socket: No; SMD: Yes; Sense: No; Manufacturer1 Example: AVX; Manufacturer1 ComponentHeight: 0.9mm; HelpURL: \\cern.ch\dfs\Applications\Altium\Datasheets\CC0603_C0G_AVX.pdf; Author: CERN DEM JLC; CreateDate: 15.06.2017; LatestRevisionDate: 15.06.2017
D21 = BAV199: Serial Diode; Part Description: Low-Leakage Double Diode; Manufacturer: NXP SEMICONDUCTORS; Voltage: 75V; Power: 250mW; PressFit: No; Bonding: No; Part Number: BAV199; Component Kind: Standard; Component Type: Standard; Device: BAV199; PackageDescription: SOT23 3-Leads, Pitch 0.95mm - Body 1.4x3mm, IPC Medium Density; Manufacturer Part Number: BAV199; Pin Count: 3; Case: SOT23-3; Mounted: Yes; Socket: No; SMD: Yes; Sense: No; ComponentHeight: 1.1mm; HelpURL: \\cern.ch\dfs\Applications\Altium\Datasheets\BAV199.pdf; Author: CERN DEM JMW; CreateDate: 2008-11-21; LatestRevisionDate: 2008-11-21
IC5 = OA_OPA2197IDGKR: 36-V, Precision, Rail-to-Rail Input Output, Low Offset Voltage Op Amp 8-VSSOP; Part Description: High-Precision, Low-Noise, Rail-to-Rail Output,10-MHz Op Amp; Manufacturer: TEXAS INSTRUMENTS; PressFit: No; Bonding: No; Part Number: OPA2197IDGKR; Component Kind: Standard; Component Type: Standard; Device: OPA2197IDGKR; PackageDescription: SOP, 0.65mm pitch; 8 pin, 3.00mm W X 3.00mm L X 1.10mm H body, IPC Medium Density; Manufacturer Part Number: OPA2197IDGKR; Pin Count: 8; Case: MSOP8; Mounted: Yes; Socket: No; SMD: Yes; Sense: No; ComponentHeight: 1.1mm; Author: GK; HelpURL: \\cern.ch\dfs\Applications\Altium\Datasheets\OPA2140AIDGK.pdf; CreateDate: 20.04.2017; LatestRevisionDate: 20.04.2017
IC37 = AD5542ABCPZ-REEL7: 2.7V to 5.5V, Serial-Input, Voltage-Output, 16-Bit DAC; Manufacturer: ANALOG DEVICES; PressFit: No; Bonding: No; Part Number: AD5542ABCPZ-REEL7; Component Kind: Standard; Component Type: Standard; Device: AD5542ABCPZ-REEL7; PackageDescription: QFN, 0.50mm Pitch, Square; 16 Pin, 3.00mm L X 3.00mm W X 0.80mm H Body (w/Thermal Tab 1.75 X 1.75mm),  IPC Medium Density; Part Description: 2.7V to 5.5V, Serial-Input, Voltage-Output, 16-Bit DAC; Manufacturer Part Number: AD5542ABCPZ-REEL7; Pin Count: 17; Case: QFN16; Mounted: Yes; Socket: No; SMD: Yes; Sense: No; ComponentHeight: 0.8mm; Author: CERN DEM JLC; HelpURL: \\cern.ch\dfs\Applications\Altium\Datasheets\AD5542ABCPZ-REEL7.pdf; CreateDate: 29.11.2018; LatestRevisionDate: 29.11.2018
L2 L16 L18 = IND0402_MURATA_BLM15HD601SN1: Inductor; Part Description: SMD EMIFIL Suppression Chip Ferrite Bead; Manufacturer: MURATA; Manufacturer Part Number: BLM15HD601SN1D; Power: 300mA; Resistance: 0.85R; Tolerance: ±25%; Part Number: IND0402_MURATA_BLM15HD601SN1; Component Kind: Standard; Component Type: Standard; Pin Count: 2; Value: 600R@100MHz; Status: None; Case: 0402; Mounted: Yes; Socket: No; SMD: Yes; Sense: No; ComponentHeight: 0.55mm; HelpURL: \\cern.ch\dfs\Applications\Altium\Datasheets\IND0402_MURATA_BLM15H.pdf; Author: CERN DEM JLC; CreateDate: 28/02/2012; LatestRevisionDate: 28/02/2012
R2 = R0603_30R_1%_0.1W_100PPM: Resistor - 1%; Part Description: General Purpose Thick Film Chip Resistor; Manufacturer: GENERIC; Manufacturer1 Part Number: NRC06F30R0TRF; Power: 0.1W; TC: ±100ppm/°C; PressFit: No; Part Number: R0603_30R_1%_0.1W_100PPM; Component Kind: Standard; Component Type: Standard; Pin Count: 2; Value: 30; Status: Preferred; Tolerance: ±1%; Manufacturer Part Number: R0603_30R_1%_0.1W_100PPM; Case: 0603; Mounted: Yes; Sense: No; Socket: No; SMD: Yes; Manufacturer1 Example: NIC COMPONENT; Manufacturer1 ComponentHeight: 0.55mm; HelpURL: \\cern.ch\dfs\Applications\Altium\Datasheets\R0603_NIC_NRC.pdf; Author: CERN DEM JLC; CreateDate: 03/12/2007; LatestRevisionDate: 13/03/2008
R9 = R0603_1K47_0.1%_0.063W_10PPM: Resistor - 0.1%; Part Description: Thin Film Chip Resistor; Manufacturer: GENERIC; Manufacturer1 Part Number: RN73C1J1K47BTDF; Power: 0.063W; TC: ±10ppm; PressFit: No; Part Number: R0603_1K47_0.1%_0.063W_10PPM; Component Kind: Standard; Component Type: Standard; Pin Count: 2; Value: 1k47; Status: Not Recommended; Tolerance: ±0.1%; Manufacturer Part Number: R0603_1K47_0.1%_0.063W_10PPM; Case: 0603; Mounted: Yes; Sense: No; Socket: No; SMD: Yes; Manufacturer1 Example: TYCO HOLSWORTHY; Manufacturer1 ComponentHeight: 0.5mm; HelpURL: \\cern.ch\dfs\Applications\Altium\Datasheets\R0603_Tyco_RN73.pdf; Author: CERN DEM JLC; CreateDate: 03.12.2007; LatestRevisionDate: 13.03.2008
R11 = R0603_1K69_0.1%_0.063W_10PPM: Resistor - 0.1%; Part Description: Thin Film Chip Resistor; Manufacturer: GENERIC; Manufacturer1 Part Number: RN73C1J1K69BTDF; Power: 0.063W; TC: ±10ppm; PressFit: No; Part Number: R0603_1K69_0.1%_0.063W_10PPM; Component Kind: Standard; Component Type: Standard; Pin Count: 2; Value: 1k69; Status: Not Recommended; Tolerance: ±0.1%; Manufacturer Part Number: R0603_1K69_0.1%_0.063W_10PPM; Case: 0603; Mounted: Yes; Sense: No; Socket: No; SMD: Yes; Manufacturer1 Example: TYCO HOLSWORTHY; Manufacturer1 ComponentHeight: 0.5mm; HelpURL: \\cern.ch\dfs\Applications\Altium\Datasheets\R0603_Tyco_RN73.pdf; Author: CERN DEM JLC; CreateDate: 03.12.2007; LatestRevisionDate: 13.03.2008
R67 = R0603_0R_JUMPER: Resistor; Part Description: 1A (0.05R Max DC Resistance) Zero Ohm Jumper; Manufacturer: GENERIC; Manufacturer1 Part Number: NRC06Z0; PressFit: No; Part Number: R0603_0R_JUMPER; Component Kind: Standard; Component Type: Standard; Pin Count: 2; Value: 0; Status: Preferred; Manufacturer Part Number: R0603_0R_JUMPER; Case: 0603; Mounted: Yes; Sense: No; Socket: No; SMD: Yes; Manufacturer1 Example: NIC COMPONENT; Manufacturer1 ComponentHeight: 0.55mm; HelpURL: \\cern.ch\dfs\Applications\Altium\Datasheets\R0603_NIC_NRC.pdf; Author: CERN DEM JLC; CreateDate: 03.12.2007; LatestRevisionDate: 13.03.2008
R153 = R0402_0R_JUMPER: Resistor; Part Description: 1A (0.05R Max DC Resistance) Zero Ohm Jumper; Manufacturer: GENERIC; Manufacturer1 Part Number: 232270591001L; PressFit: No; Part Number: R0402_0R_JUMPER; Component Kind: Standard; Component Type: Standard; Pin Count: 2; Value: 0; Status: Not Recommended; Manufacturer Part Number: R0402_0R_JUMPER; Case: 0402; Mounted: Yes; Sense: No; Socket: No; SMD: Yes; Manufacturer1 Example: YAGEO PHYCOMP; Manufacturer1 ComponentHeight: 0.4mm; HelpURL: \\cern.ch\dfs\Applications\Altium\Datasheets\R0402_Phycomp_RC0402.pdf; Author: CERN DEM JLC; CreateDate: 03.12.2007; LatestRevisionDate: 17.10.2012
R164 = R0402_10R_1%_0.0625W_200PPM: Resistor - 1%; Part Description: General Purpose Thick Film Chip Resistor; Manufacturer: GENERIC; Manufacturer1 Part Number: 232270671009L; TC: ±200ppm/°C; PressFit: No; Part Number: R0402_10R_1%_0.0625W_200PPM; Component Kind: Standard; Component Type: Standard; Pin Count: 2; Value: 10; Status: Not Recommended; Power: 0.0625W; Tolerance: ±1%; Manufacturer Part Number: R0402_10R_1%_0.0625W_200PPM; Case: 0402; Mounted: Yes; Sense: No; Socket: No; SMD: Yes; Manufacturer1 Example: YAGEO PHYCOMP; Manufacturer1 ComponentHeight: 0.4mm; HelpURL: \\cern.ch\dfs\Applications\Altium\Datasheets\R0402_Phycomp_RC0402.pdf; Author: CERN DEM JLC; CreateDate: 24.06.2009; LatestRevisionDate: 17.10.2012
R297 = R0201_0R_JUMPER: Resistor; Part Description: 1A (0.05R Max DC Resistance) Zero Ohm Jumper; Manufacturer: GENERIC; Manufacturer1 Part Number: CRCW02010000Z0ED; PressFit: No; Part Number: R0201_0R_JUMPER; Component Kind: Standard; Component Type: Standard; Pin Count: 2; Value: 0; Status: Not Recommended; Manufacturer Part Number: R0201_0R_JUMPER; Case: 0201; Mounted: Yes; Sense: No; Socket: No; SMD: Yes; Manufacturer1 Example: VISHAY; Manufacturer1 ComponentHeight: 0.27mm; HelpURL: \\cern.ch\dfs\Applications\Altium\Datasheets\R0201_VISHAY_CRCW e3.pdf; Author: CERN DEM JLC; CreateDate: 19.11.2014; LatestRevisionDate: 08.01.2015
RN1 = RES_RN_100R_YAGEO_TC124-JR-07100RL: DIL8 Resistor Network 4 Isolated Resistor 5%; Part Description: Chip Resistor Array , 4 Isolated Resistors (Side Concave Terminal), TC124 Series; Manufacturer: YAGEO; Power: 0.062W; TC: ±200ppm/°C; PressFit: No; Part Number: RN_100R_YAGEO_TC124-JR-07100RL; Component Kind: Standard; Component Type: Standard; Pin Count: 8; Value: 100; Sense: No; Status: Not recommended; Tolerance: ±5%; Manufacturer Part Number: TC124-JR-07100RL; Case: 0408; Mounted: Yes; Socket: No; SMD: Yes; ComponentHeight: 0.5mm; HelpURL: \\cern.ch\dfs\Applications\Altium\Datasheets\RN_YAGEO_TC124.pdf; Author: CERN DEM BC; CreateDate: 06.05.2019; LatestRevisionDate: 06.05.2019
RN5 = RN_10K_VISHAY_AORN1002A: DIL8 Resistor Network 4 Isolated Resistor 0.1%; Part Description: Dual-In-Line Thin Film Precision Automotive Resistors Network, (4 Isolated) - AORN Series; Manufacturer: VISHAY DALE; Power: 4x0.1W; TC: ±25ppm/°C; PressFit: No; Part Number: RN_10K_VISHAY_AORN1002A; Component Kind: Standard; Component Type: Standard; Pin Count: 8; Value: 10k; Sense: No; Tolerance: ±0.1%; Case: SOIC8; Mounted: Yes; Socket: No; SMD: Yes; ComponentHeight: 1.73mm; HelpURL: \\cern.ch\dfs\Applications\Altium\Datasheets\RN_VISHAY_AORN.pdf; Author: CERN DEM JLC; CreateDate: 20.02.2017; LatestRevisionDate: 03.05.2017

## Sheet HV_DAC_8ch_FPGA.SchDoc: Fastino
size 420 x 297 mm; EDA_Number: ARTIQ; Projet: Fastino; Author: G.Kasprowicz; CompanyName: WUT ISE; DrawnBy: G.Kasprowicz; Organization: WUT ISE; Address1: PW ISE; Address2: Nowowiejska 15/19 00-665 Warsaw; Address3: gkasprow@gmail.com; DocumentNumber: 3; Revision: 2; SheetNumber: 4; SheetTotal: 12; ModifiedBy: -; CheckedDate: -; Title2: 3.3V FPGA banks; DivGrp: WUT ISE; Designer: G.Kasprowicz; ModifiedDate: -; ProjectName: Sensor Box
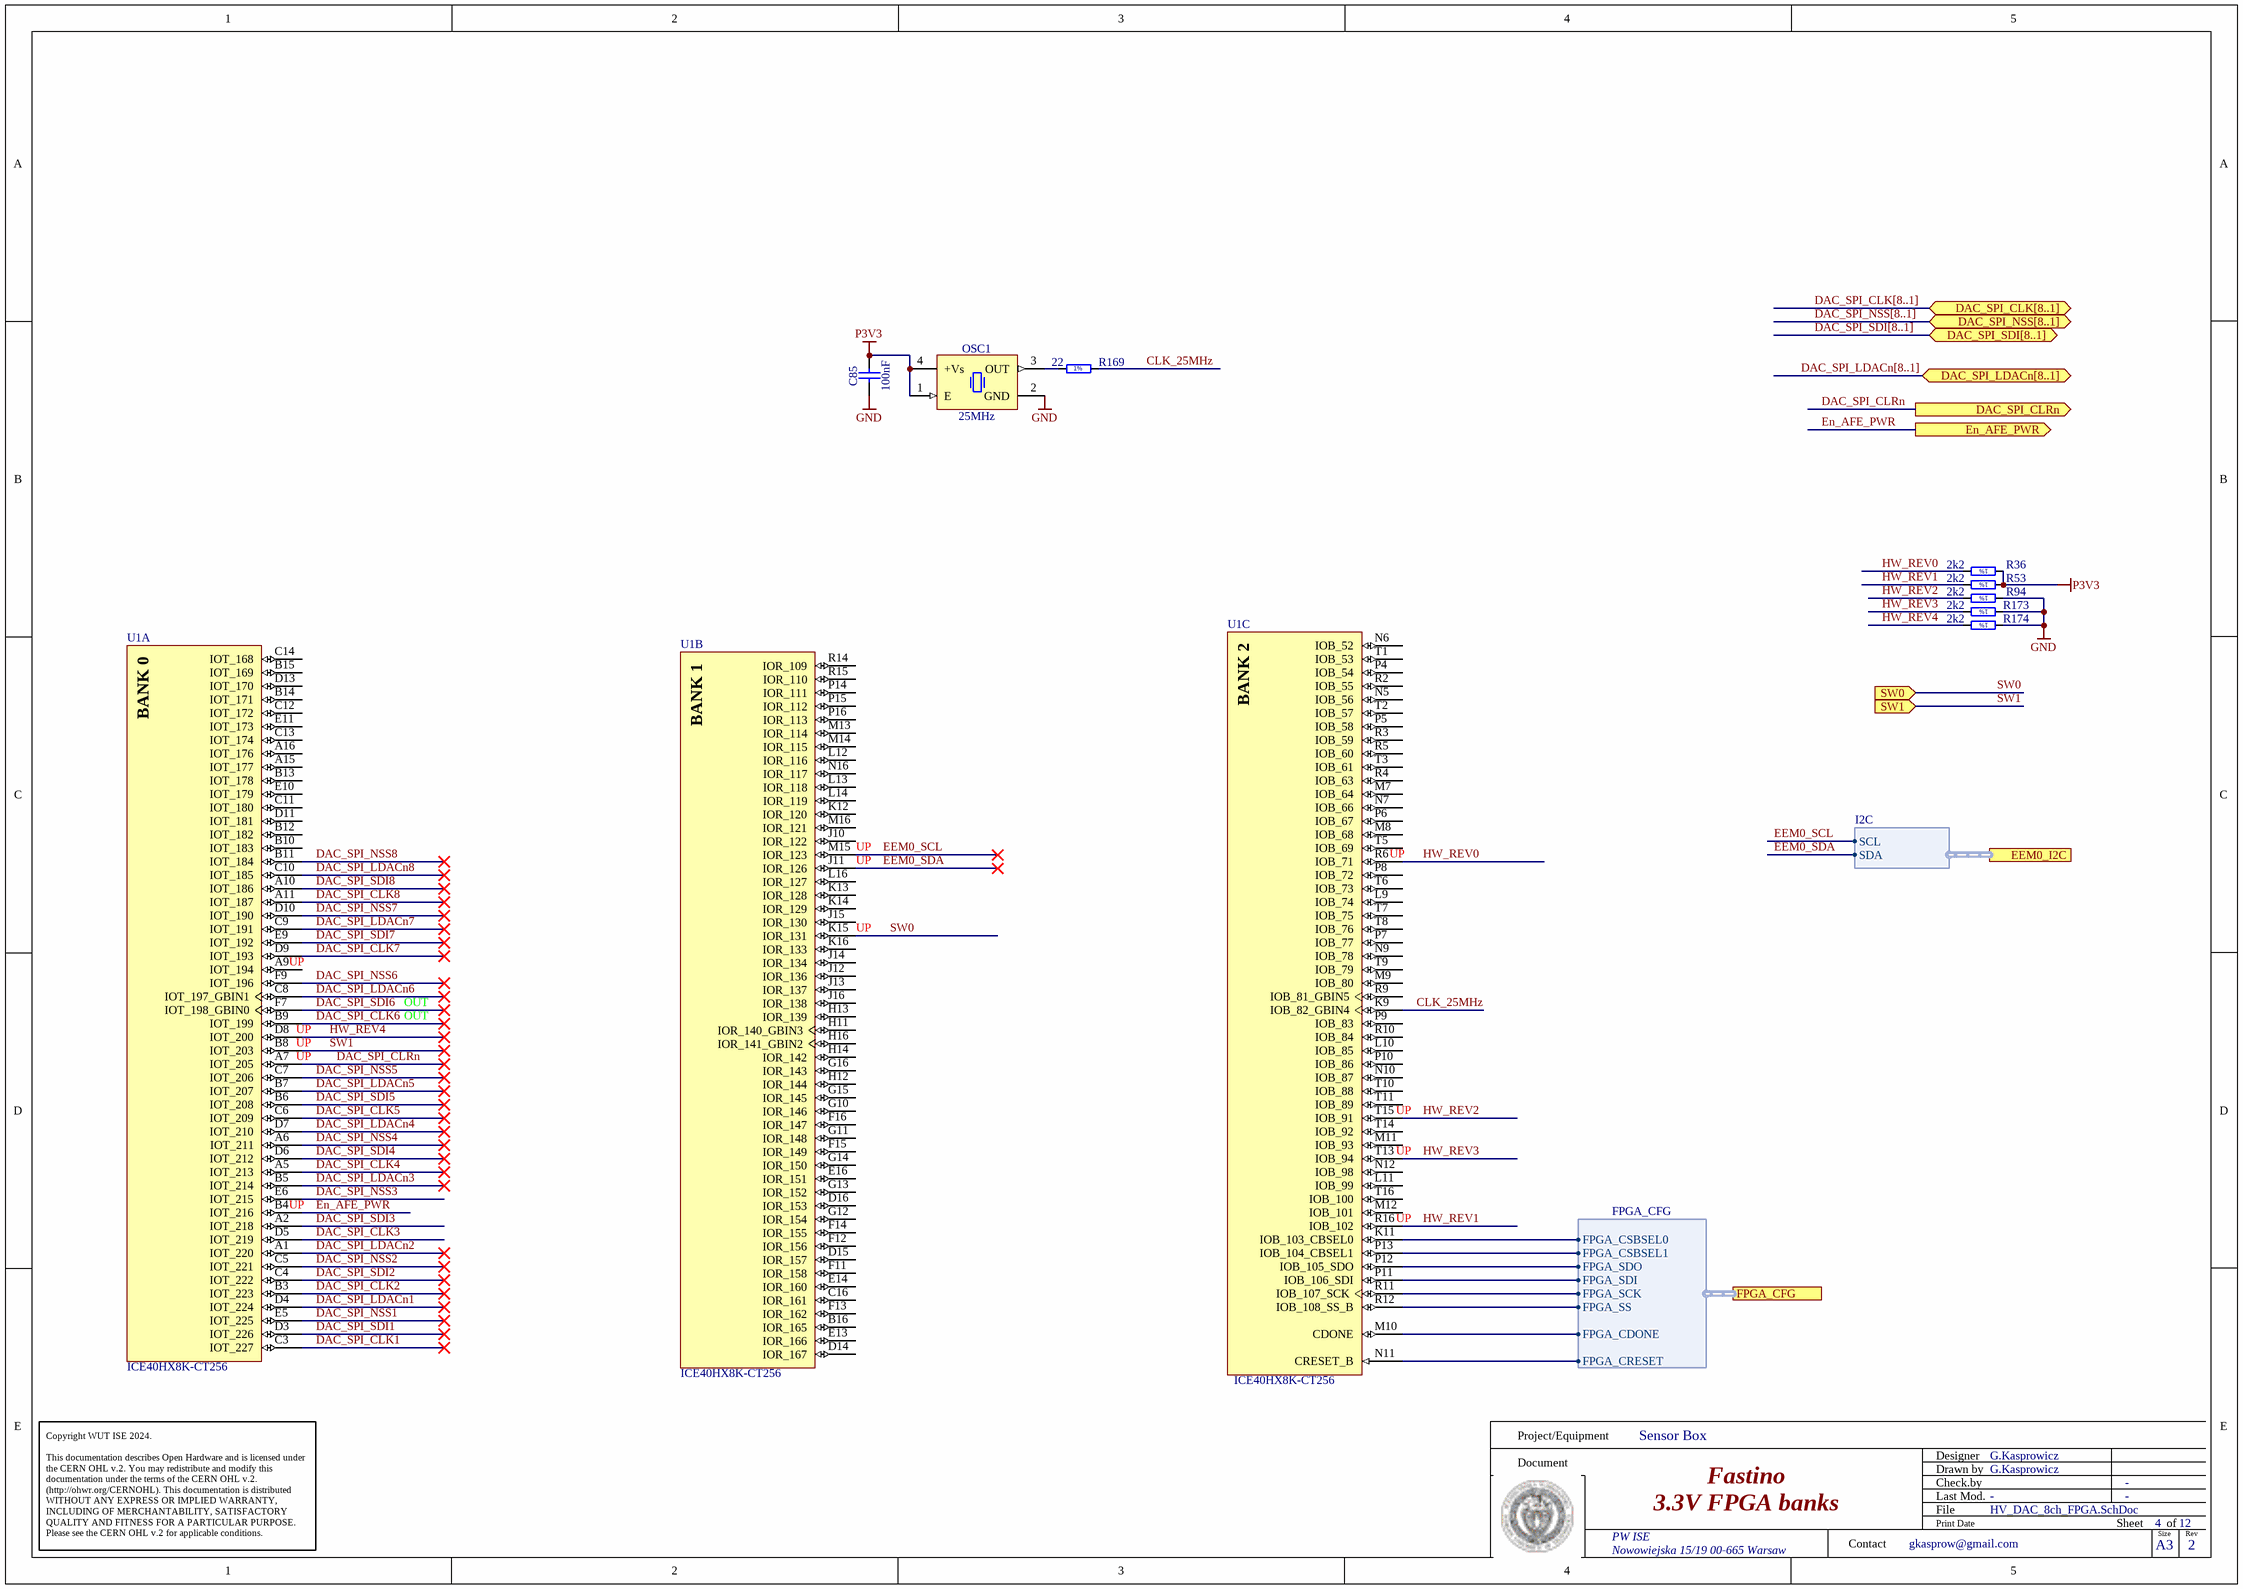
[diagram p2: HV_DAC_8ch_FPGA.SchDoc]

### Parts
C85  100nF  [CAPC1005X55N]
OSC1  25MHz  [OSC_IQD_CFPS-39]
R36  2k2  [RESC1005X40N]
R53  2k2  [RESC1005X40N]
R94  2k2  [RESC1005X40N]
R169  22  [RESC1005X40N]
R173  2k2  [RESC1005X40N]
R174  2k2  [RESC1005X40N]
U1  ICE40HX8K-CT256  [LATC-caBGA-256]  (parts A,B,C of 5)

### Ports
DAC_SPI_CLK[8..1] (bidir), DAC_SPI_CLRn (out), DAC_SPI_LDACn[8..1] (bidir), DAC_SPI_NSS[8..1] (bidir), DAC_SPI_SDI[8..1] (bidir), EEM0_I2C (harness I2C), En_AFE_PWR (out), FPGA_CFG (harness FPGA_CFG), SW0 (in), SW1 (in)

### Harnesses
FPGA_CFG: FPGA_CSBSEL0, FPGA_CSBSEL1, FPGA_SDO, FPGA_SDI, FPGA_SCK, FPGA_SS, FPGA_CDONE, FPGA_CRESET
I2C: SDA, SCL

### Nets
GND: C85.1 OSC1.2(GND) R94.1 R173.1 R174.1
P3V3: C85.2 OSC1.1(E) OSC1.4(+Vs) R36.1 R53.1
CLK_25MHz: R169.2 U1.K9(IOB_82_GBIN4)
DAC_SPI_CLK1: U1.C3(IOT_227)
DAC_SPI_CLK2: U1.B3(IOT_223)
DAC_SPI_CLK3: U1.D5(IOT_219)
DAC_SPI_CLK4: U1.A5(IOT_213)
DAC_SPI_CLK5: U1.C6(IOT_209)
DAC_SPI_CLK6: U1.B9(IOT_199)
DAC_SPI_CLK7: U1.D9(IOT_193)
DAC_SPI_CLK8: U1.A11(IOT_187)
DAC_SPI_CLRn: U1.A7(IOT_205) ; port DAC_SPI_CLRn
DAC_SPI_LDACn1: U1.D4(IOT_224)
DAC_SPI_LDACn2: U1.A1(IOT_220)
DAC_SPI_LDACn3: U1.B5(IOT_214)
DAC_SPI_LDACn4: U1.D7(IOT_210)
DAC_SPI_LDACn5: U1.B7(IOT_207)
DAC_SPI_LDACn6: U1.C8(IOT_197_GBIN1)
DAC_SPI_LDACn7: U1.C9(IOT_191)
DAC_SPI_LDACn8: U1.C10(IOT_185)
DAC_SPI_NSS1: U1.E5(IOT_225)
DAC_SPI_NSS2: U1.C5(IOT_221)
DAC_SPI_NSS3: U1.E6(IOT_215)
DAC_SPI_NSS4: U1.A6(IOT_211)
DAC_SPI_NSS5: U1.C7(IOT_206)
DAC_SPI_NSS6: U1.F9(IOT_196)
DAC_SPI_NSS7: U1.D10(IOT_190)
DAC_SPI_NSS8: U1.B11(IOT_184)
DAC_SPI_SDI1: U1.D3(IOT_226)
DAC_SPI_SDI2: U1.C4(IOT_222)
DAC_SPI_SDI3: U1.A2(IOT_218)
DAC_SPI_SDI4: U1.D6(IOT_212)
DAC_SPI_SDI5: U1.B6(IOT_208)
DAC_SPI_SDI6: U1.F7(IOT_198_GBIN0)
DAC_SPI_SDI7: U1.E9(IOT_192)
DAC_SPI_SDI8: U1.A10(IOT_186)
EEM0_SCL: U1.M15(IOR_123) ; port EEM0_I2C.SCL
EEM0_SDA: U1.J11(IOR_126) ; port EEM0_I2C.SDA
En_AFE_PWR: U1.B4(IOT_216) ; port En_AFE_PWR
FLASH_SCK: U1.R11(IOB_107_SCK) ; port FPGA_CFG.FPGA_SCK
FLASH_SDI: U1.P12(IOB_105_SDO) ; port FPGA_CFG.FPGA_SDO
FLASH_SDO: U1.P11(IOB_106_SDI) ; port FPGA_CFG.FPGA_SDI
FLASH_SS: U1.R12(IOB_108_SS_B) ; port FPGA_CFG.FPGA_SS
FPGA_CDONE: U1.M10(CDONE) ; port FPGA_CFG.FPGA_CDONE
FPGA_CRESET: U1.N11(CRESET_B) ; port FPGA_CFG.FPGA_CRESET
FPGA_CSBSEL0: U1.K11(IOB_103_CBSEL0) ; port FPGA_CFG.FPGA_CSBSEL0
FPGA_CSBSEL1: U1.P13(IOB_104_CBSEL1) ; port FPGA_CFG.FPGA_CSBSEL1
HW_REV0: R36.2 U1.R6(IOB_71)
HW_REV1: R53.2 U1.R16(IOB_102)
HW_REV2: R94.2 U1.T15(IOB_91)
HW_REV3: R173.2 U1.T13(IOB_94)
HW_REV4: R174.2 U1.D8(IOT_200)
SW0: U1.K15(IOR_131) ; port SW0
SW1: U1.B8(IOT_203) ; port SW1
NetOSC1_3: OSC1.3(OUT) R169.1

Not connected (* = marked no-connect by the designer): U1 A9(IOT_194) A15(IOT_177) A16(IOT_176) B10(IOT_183) B12(IOT_182) B13(IOT_178) B14(IOT_171) B15(IOT_169) B16(IOR_165) C11(IOT_180) C12(IOT_172) C13(IOT_174) C14(IOT_168) C16(IOR_161) D11(IOT_181) D13(IOT_170) D14(IOR_167) D15(IOR_157) D16(IOR_153) E10(IOT_179) E11(IOT_173) E13(IOR_166) E14(IOR_160) E16(IOR_151) F11(IOR_158) F12(IOR_156) F13(IOR_162) F14(IOR_155) F15(IOR_149) F16(IOR_147) G10(IOR_146) G11(IOR_148) G12(IOR_154) G13(IOR_152) G14(IOR_150) G15(IOR_145) G16(IOR_143) H11(IOR_140_GBIN3) H12(IOR_144) H13(IOR_139) H14(IOR_142) H16(IOR_141_GBIN2) J10(IOR_122) J12(IOR_136) J13(IOR_137) J14(IOR_134) J15(IOR_130) J16(IOR_138) K12(IOR_120) K13(IOR_128) K14(IOR_129) K16(IOR_133) L9(IOB_74) L10(IOB_85) L11(IOB_99) L12(IOR_116) L13(IOR_118) L14(IOR_119) L16(IOR_127) M7(IOB_64) M8(IOB_68) M9(IOB_80) M11(IOB_93) M12(IOB_101) M13(IOR_114) M14(IOR_115) M16(IOR_121) N5(IOB_56) N6(IOB_52) N7(IOB_66) N9(IOB_78) N10(IOB_87) N12(IOB_98) N16(IOR_117) P4(IOB_54) P5(IOB_58) P6(IOB_67) P7(IOB_77) P8(IOB_72) P9(IOB_83) P10(IOB_86) P14(IOR_111) P15(IOR_112) P16(IOR_113) R2(IOB_55) R3(IOB_59) R4(IOB_63) R5(IOB_60) R9(IOB_81_GBIN5) R10(IOB_84) R14(IOR_109) R15(IOR_110) T1(IOB_53) T2(IOB_57) T3(IOB_61) T5(IOB_69) T6(IOB_73) T7(IOB_75) T8(IOB_76) T9(IOB_79) T10(IOB_88) T11(IOB_89) T14(IOB_92) T16(IOB_100)

### Buses and harness runs
bus DAC_SPI_CLK[8..1] = port DAC_SPI_CLK[8..1]
bus DAC_SPI_LDACn[8..1] = port DAC_SPI_LDACn[8..1]
bus DAC_SPI_NSS[8..1] = port DAC_SPI_NSS[8..1]
bus DAC_SPI_SDI[8..1] = port DAC_SPI_SDI[8..1]

### Notes on the sheet
- (near U1) UP
- OUT
- Project/Equipment
- Document
- Designer
- Drawn by
- Check.by
- Copyright WUT ISE 2024.
  This documentation describes Open Hardware and is licensed under the CERN OHL v.2. You may redistribute and modify this documentation under the terms of the CERN OHL v.2. (http://ohwr.org/CERNOHL). This documentation is distributed WITHOUT ANY EXPRESS OR IMPLIED WARRANTY, INCLUDING OF MERCHANTABILITY, SATISFACTORY QUALITY AND FITNESS FOR A PARTICULAR PURPOSE. Please see the CERN OHL v.2 for applicable conditions.
- Contact
- File
- Last Mod.
- Print Date
- Sheet
- Size
- A3
- of
- Rev
- (in symbol CMP-0962-00001-1, part A) BANK 0
- (in symbol CMP-0962-00001-1, part B) BANK 1
- (in symbol CMP-0962-00001-1, part C) BANK 2
- (in symbol R0402_2K2_1%_0.0625W_100PPM) 1%
- (in symbol R0402_22R_1%_0.0625W_100PPM) 1%

### Library data of the parts
C85 = CC0402_100NF_16V_10%_X5R: as C170 on sheet HV_DAC_8ch-DIOT; Part Number: CC0402_100NF_16V_10%_X5R; Component Kind: Standard; Component Type: Standard; Pin Count: 2; Value: 100nF; Status: None; Manufacturer Part Number: CC0402_100NF_16V_10%_X5R; Case: 0402; Mounted: Yes; Socket: No; SMD: Yes; Sense: No; Manufacturer1 Example: MURATA; Manufacturer1 ComponentHeight: 0.55mm; HelpURL: \\cern.ch\dfs\Applications\Altium\Datasheets\CC0402_X5R_MURATA_GRM.pdf; Author: CERN DEM JLC; CreateDate: 10.12.2013; LatestRevisionDate: 10.12.2013
OSC1 = OSC_25MHZ_IQD_LFSPXO025165: Oscillator 4 pins 1=E 2=GND 3=OUT 4=+Vs; Part Description: 3.3V, ±50ppm, 15pF, -40 to 85°C, CMOS Surface Mount Clock Oscillator (CFPS-39 Series); Manufacturer: IQD FREQUENCY PRODUCTS; PressFit: No; Bonding: No; Part Number: OSC_25MHZ_IQD_LFSPXO025165; Component Kind: Standard; Component Type: Standard; PackageDescription: Oscillator, Corner Concave, 2.20mm Pitch, 4 Pins, 2.70mm L X 3.40mm W X 1.20mm H, CFPS-39 Series; Value: 25MHz; Manufacturer Part Number: LFSPXO025165; Pin Count: 4; Mounted: Yes; Socket: No; SMD: Yes; Sense: No; ComponentHeight: 1.2mm; HelpURL: \\cern.ch\dfs\Applications\Altium\Datasheets\OSC_IQD_LFSPXO025165.pdf; Author: CERN DEM JLC; CreateDate: 02.12.2010; LatestRevisionDate: 03.11.2016
R36 R53 R94 R173 R174 = R0402_2K2_1%_0.0625W_100PPM: Resistor - 1%; Part Description: General Purpose Thick Film Chip Resistor; Manufacturer: GENERIC; Manufacturer1 Part Number: 232270672202L; TC: ±100ppm/°C; Table: Resistors SMD; Part Number: R0402_2K2_1%_0.0625W_100PPM; Component Kind: Standard; Component Type: Standard; Pin Count: 2; Value: 2k2; Status: Not recommended; Power: 0.0625W; Tolerance: ±1%; Manufacturer Part Number: R0402_2K2_1%_0.0625W_100PPM; Case: 0402; Mounted: Yes; Socket: No; SMD: Yes; Manufacturer1 Example: YAGEO PHYCOMP; Manufacturer1 ComponentHeight: 0.4mm; HelpURL: \\cern.ch\dfs\Applications\Altium\Datasheets\R0402_Phycomp_RC0402.pdf; Author: CERN DEM JLC; CreateDate: 2007-12-03; LatestRevisionDate: 2012-10-17
R169 = R0402_22R_1%_0.0625W_100PPM: Resistor - 1%; Part Description: General Purpose Thick Film Chip Resistor; Manufacturer: GENERIC; Manufacturer1 Part Number: 232270672209L; TC: ±100ppm/°C; PressFit: No; Part Number: R0402_22R_1%_0.0625W_100PPM; Component Kind: Standard; Component Type: Standard; Pin Count: 2; Value: 22; Status: Not Recommended; Power: 0.0625W; Tolerance: ±1%; Manufacturer Part Number: R0402_22R_1%_0.0625W_100PPM; Case: 0402; Mounted: Yes; Sense: No; Socket: No; SMD: Yes; Manufacturer1 Example: YAGEO PHYCOMP; Manufacturer1 ComponentHeight: 0.4mm; HelpURL: \\cern.ch\dfs\Applications\Altium\Datasheets\R0402_Phycomp_RC0402.pdf; Author: CERN DEM JLC; CreateDate: 03/12/2007; LatestRevisionDate: 17/10/2012
U1 = CMP-0962-00001-1: iCE40 HX8K Series FPGA Family, 7680 Logic Cells, 1.2 V Core, 128 K Embedded RAM Bits, 256-ball caBGA, Pb-Free, Tray; Manufacturer: Lattice Semiconductor; Supply Voltage: 1.2V; Phase-Locked Loops: 2; Logic Cells: 7680; Embedded RAM Bits: 128K; PackageReference: caBGA-256; PackageDescription: 256-Ball Chip Array Ball Grid Array, Body 14 x 14 mm, Pitch 0.8 mm; RoHS: TRUE; Packing: Tray; Mounting Technology: Surface Mount; ComponentLink3URL: http://www.latticesemi.com/lit/docs/package/pkg.pdf; ComponentLink1Description: Manufacturer URL; ComponentLink3Description: Package Specification; Code_JEDEC: MO-275; PackageVersion: Rev. 03.9, 02/2013; ComponentLink1URL: http://www.latticesemi.com/en; ComponentLink2URL: http://www.latticesemi.com/~/media/Documents/DataSheets/iCE/iCE40LPHXFamilyDataSheet.pdf; Manufacturer Part Number: ICE40HX8K-CT256; ComponentLink2Description: Datasheet; DatasheetVersion: Rev. 02.9